# Altium project DAL_OBC_V10.PrjPcb (part 5 of 9)

## Sheet SAMA7G54_MPU.SchDoc
size 420 x 297 mm; SheetNumber: 10; SheetTotal: 34
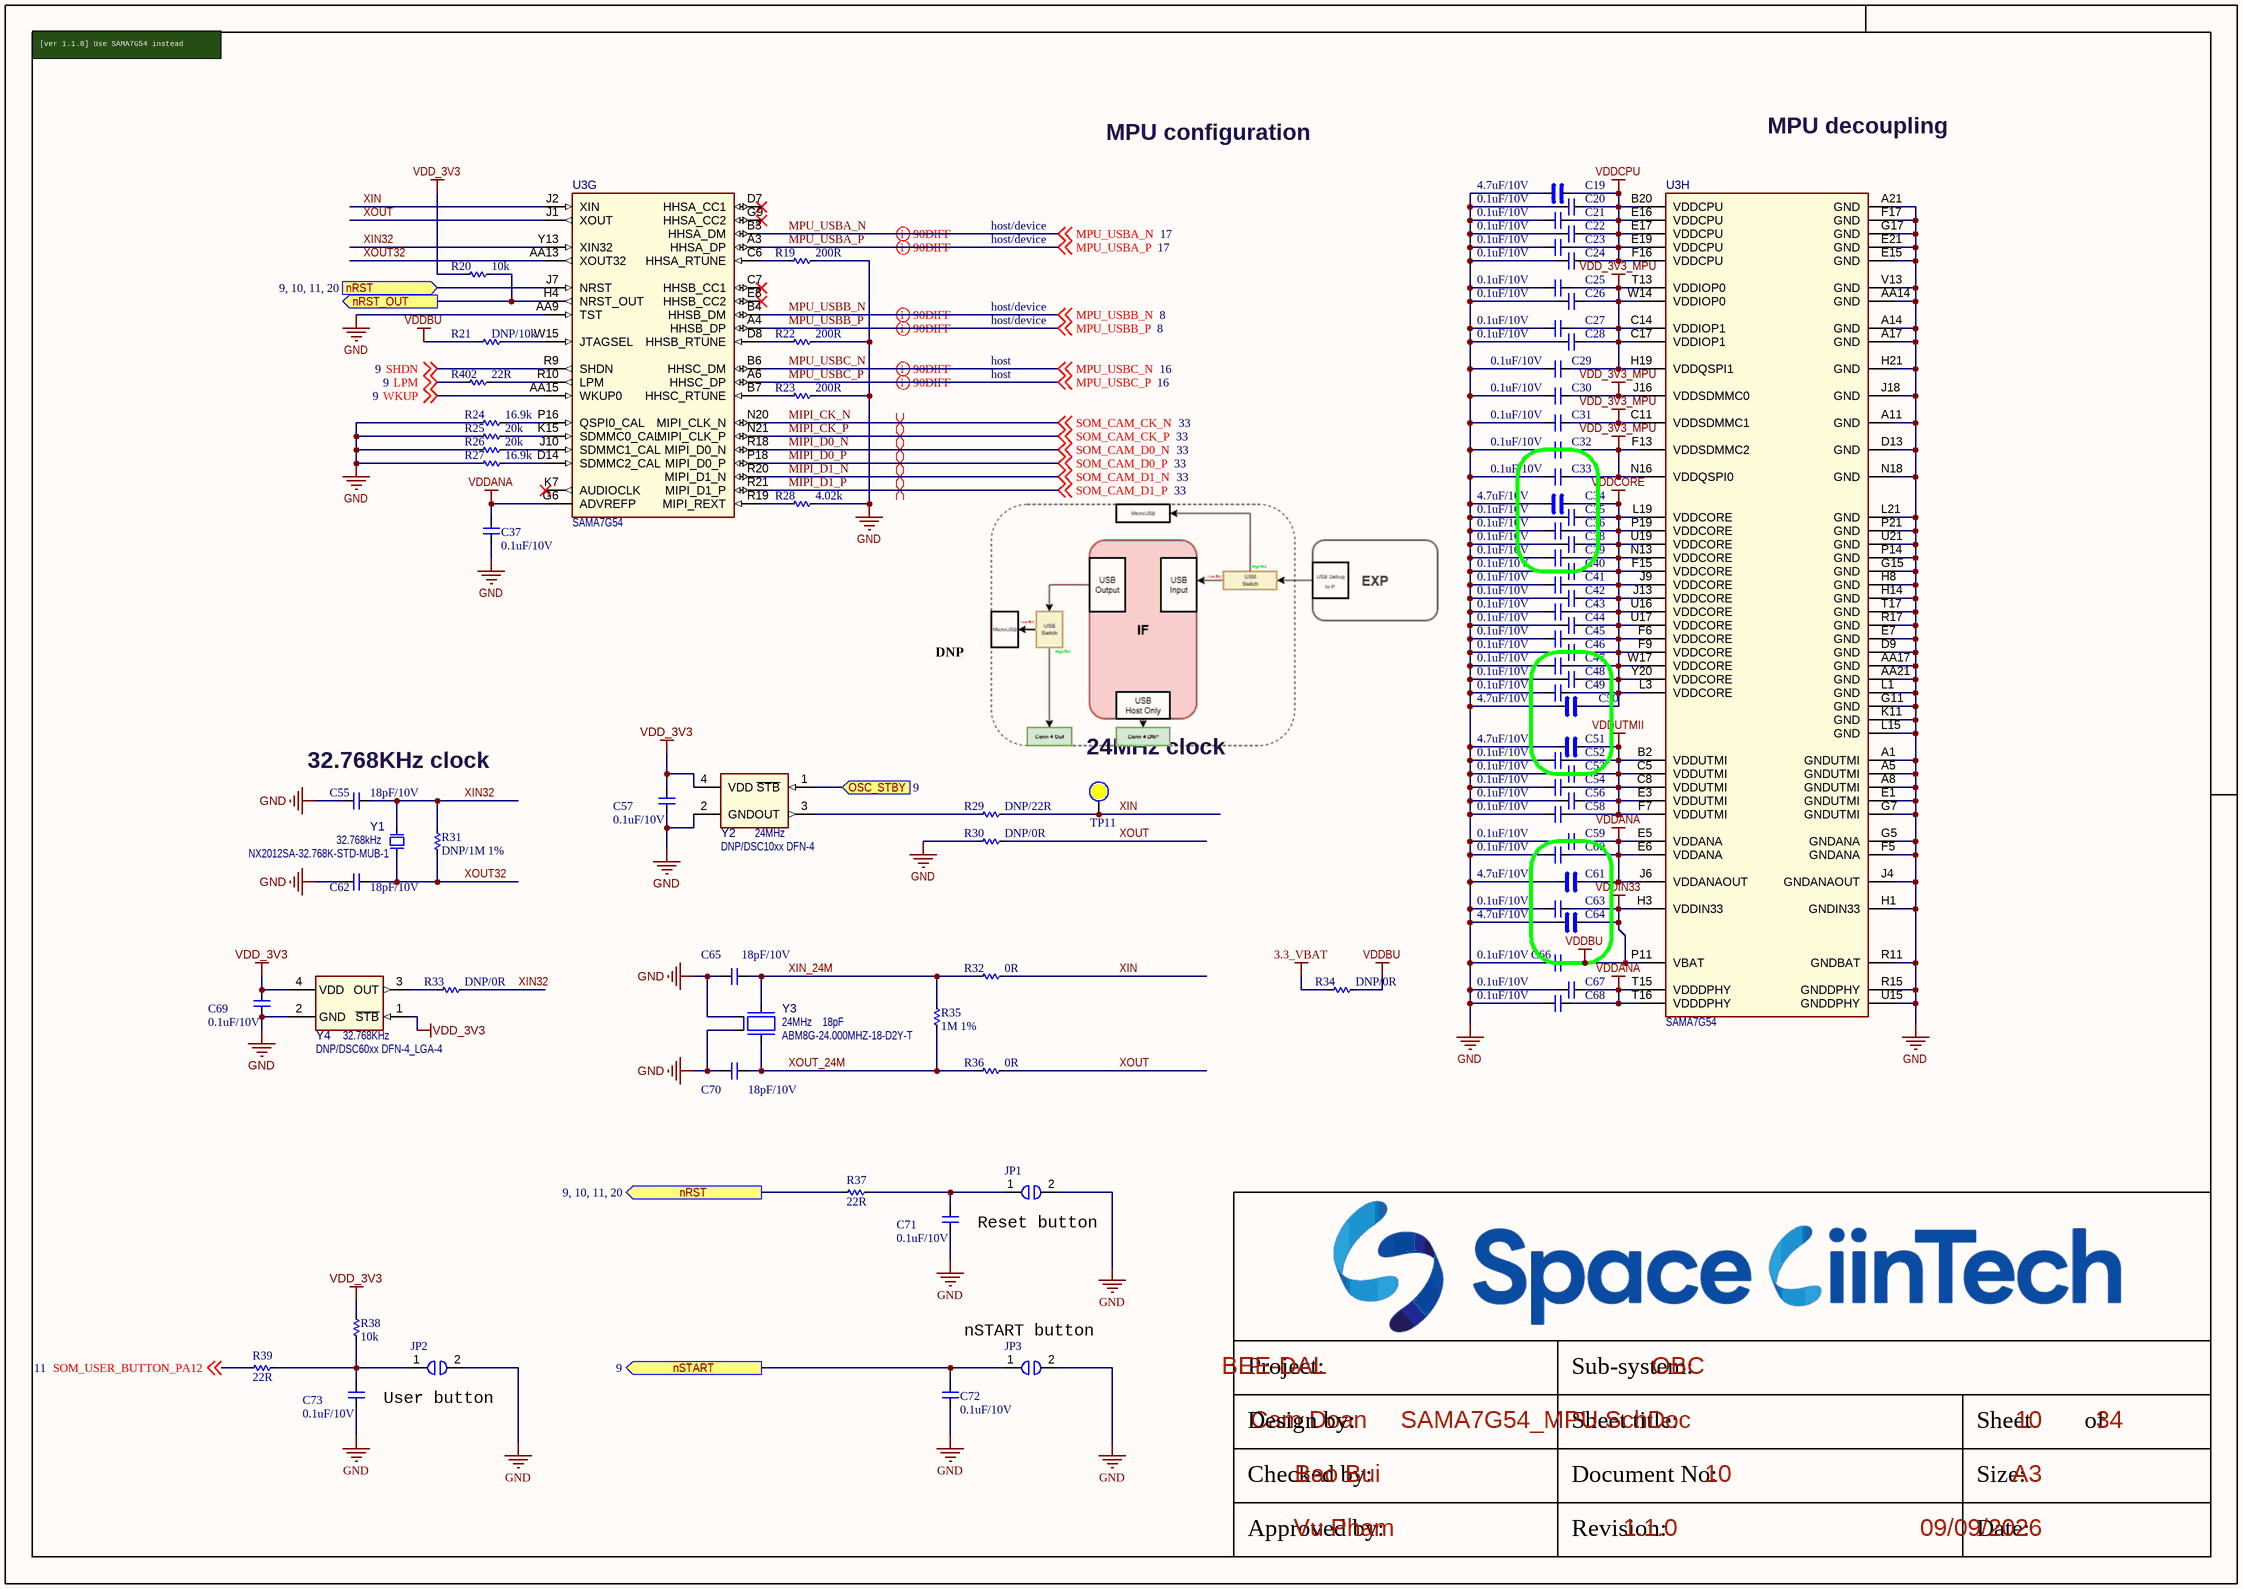
[diagram p9: SAMA7G54_MPU.SchDoc]

### Parts
C19  4.7uF/10V  [CAP_C_1005X50_L]
C20  0.1uF/10V  [CAP_C_0603x30]
C21  0.1uF/10V  [CAP_C_0603x30]
C22  0.1uF/10V  [CAP_C_0603x30]
C23  0.1uF/10V  [CAP_C_0603x30]
C24  0.1uF/10V  [CAP_C_0603x30]
C25  0.1uF/10V  [CAP_C_0603x30]
C26  0.1uF/10V  [CAP_C_0603x30]
C27  0.1uF/10V  [CAP_C_0603x30]
C28  0.1uF/10V  [CAP_C_0603x30]
C29  0.1uF/10V  [CAP_C_0603x30]
C30  0.1uF/10V  [CAP_C_0603x30]
C31  0.1uF/10V  [CAP_C_0603x30]
C32  0.1uF/10V  [CAP_C_0603x30]
C33  0.1uF/10V  [CAP_C_0603x30]
C34  4.7uF/10V  [CAP_C_1005X50_L]
C35  0.1uF/10V  [CAP_C_0603x30]
C36  0.1uF/10V  [CAP_C_0603x30]
C37  0.1uF/10V  [CAP_C_0603x30]
C38  0.1uF/10V  [CAP_C_0603x30]
C39  0.1uF/10V  [CAP_C_0603x30]
C40  0.1uF/10V  [CAP_C_0603x30]
C41  0.1uF/10V  [CAP_C_0603x30]
C42  0.1uF/10V  [CAP_C_0603x30]
C43  0.1uF/10V  [CAP_C_0603x30]
C44  0.1uF/10V  [CAP_C_0603x30]
C45  0.1uF/10V  [CAP_C_0603x30]
C46  0.1uF/10V  [CAP_C_0603x30]
C47  0.1uF/10V  [CAP_C_0603x30]
C48  0.1uF/10V  [CAP_C_0603x30]
C49  0.1uF/10V  [CAP_C_0603x30]
C50  4.7uF/10V  [CAP_C_1005X50_L]
C51  4.7uF/10V  [CAP_C_1005X50_L]
C52  0.1uF/10V  [CAP_C_0603x30]
C53  0.1uF/10V  [CAP_C_0603x30]
C54  0.1uF/10V  [CAP_C_0603x30]
C55  18pF/10V  [CAP_C_1005X50_L]
C56  0.1uF/10V  [CAP_C_0603x30]
C57  0.1uF/10V  [CAP_C_1005X50_L]
C58  0.1uF/10V  [CAP_C_0603x30]
C59  0.1uF/10V  [CAP_C_0603x30]
C60  0.1uF/10V  [CAP_C_0603x30]
C61  4.7uF/10V  [CAP_C_1005X50_L]
C62  18pF/10V  [CAP_C_1005X50_L]
C63  0.1uF/10V  [CAP_C_0603x30]
C64  4.7uF/10V  [CAP_C_1005X50_L]
C65  18pF/10V  [CAP_C_1005X50_L]
C66  0.1uF/10V  [CAP_C_0603x30]
C67  0.1uF/10V  [CAP_C_0603x30]
C68  0.1uF/10V  [CAP_C_0603x30]
C69  0.1uF/10V  [CAP_C_1005X50_L]
C70  18pF/10V  [CAP_C_1005X50_L]
C71  0.1uF/10V  [CAP_C_1005X50_L]
C72  0.1uF/10V  [CAP_C_1005X50_L]
C73  0.1uF/10V  [CAP_C_1005X50_L]
JP1  (no value)  [JUMPER_1608]
JP2  (no value)  [JUMPER_1608]
JP3  (no value)  [JUMPER_1608]
R19  200R  [RES_C_0603X30]
R20  10k  [RES_C_1005x30_L]
R21  DNP/10k  [RES_C_1005x30_L]
R22  200R  [RES_C_0603X30]
R23  200R  [RES_C_0603X30]
R24  16.9k  [RES_C_0603X30]
R25  20k  [RES_C_1005x30_L]
R26  20k  [RES_C_1005x30_L]
R27  16.9k  [RES_C_0603X30]
R28  4.02k  [RES_C_1005x30_L]
R29  DNP/22R  [RES_C_1005x30_L]
R30  DNP/0R  [RES_C_1005x30_L]
R31  DNP/1M 1%  [RES_C_1005x30_L]
R32  0R  [RES_C_1005x30_L]
R33  DNP/0R  [RES_C_1005x30_L]
R34  DNP/0R  [RES_C_1005x30_L]
R35  1M 1%  [RES_C_1005x30_L]
R36  0R  [RES_C_1005x30_L]
R37  22R  [RES_C_1005x30_L]
R38  10k  [RES_C_1005x30_L]
R39  22R  [RES_C_1005x30_L]
R402  22R  [RES_C_1005x30_L]
TP11  (no value)  [Testpoint_80_pin0]  (no BOM)
U3  SAMA7G54  [TFBGA-343_14x14 - 2.5mm]  (parts G,H of 8)
Y1  value 32.768kHz  Manufacturer Part Number 1: NX2012SA-32.768K-STD-MUB-1  [CRYSTAL_NX2012SA]  (hidden comment: Crystal 2 Pins)
Y2  DNP/DSC10xx DFN-4  value 24MHz  [DFN-4_2.5x2]
Y3  value 24MHz  Load Capacitance: 18pF  Manufacturer Part Number 1: ABM8G-24.000MHZ-18-D2Y-T  [CRYSTAL_ABM8G]  (hidden comment: Crystal 4 Pins)
Y4  DNP/DSC60xx DFN-4_LGA-4  value 32.768KHz  [DFN-4_2x1.6]

### Ports
nRST (in, see 9, 10, 11, 20), nRST (out, see 9, 10, 11, 20), nRST_OUT (out), nSTART (out, see 9), OSC_STBY (in, see 9)

### Nets
3.3_VBAT: R34.1
GND: C19.2 C20.2 C21.2 C22.2 C23.2 C24.2 C25.2 C26.2 C27.2 C28.2 C29.2 C30.2 C31.2 C32.2 C33.2 C34.2 C35.2 C36.2 C37.1 C38.2 C39.2 C40.2 C41.2 C42.2 C43.2 C44.2 C45.2 C46.2 C47.2 C48.2 C49.2 C50.2 C51.2 C52.2 C53.2 C54.2 C55.2 C56.2 C57.1 C58.2 C59.2 C60.2 C61.2 C62.2 C63.2 C64.2 C65.2 C66.2 C67.2 C68.2 C69.1 C70.2 C71.1 C72.2 C73.1 JP1.2 JP2.2 JP3.2 R19.1 R22.1 R23.1 R24.2 R25.2 R26.2 R27.2 R28.1 R30.1 U3.A1(GNDUTMI) U3.A5(GNDUTMI) U3.A8(GNDUTMI) U3.A11(GND) U3.A14(GND) U3.A17(GND) U3.A21(GND) U3.AA9(TST) U3.AA14(GND) U3.AA17(GND) U3.AA21(GND) U3.D9(GND) U3.D13(GND) U3.E1(GNDUTMI) U3.E7(GND) U3.E15(GND) U3.E21(GND) U3.F5(GNDANA) U3.F17(GND) U3.G5(GNDANA) U3.G7(GNDUTMI) U3.G11(GND) U3.G15(GND) U3.G17(GND) U3.H1(GNDIN33) U3.H8(GND) U3.H14(GND) U3.H21(GND) U3.J4(GNDANAOUT) U3.J18(GND) U3.K11(GND) U3.L1(GND) U3.L15(GND) U3.L21(GND) U3.N18(GND) U3.P14(GND) U3.P21(GND) U3.R11(GNDBAT) U3.R15(GNDDPHY) U3.R17(GND) U3.T17(GND) U3.U15(GNDDPHY) U3.U21(GND) U3.V13(GND) Y2.2(GND) Y3.2(GND) Y3.4(GND) Y4.2(GND)  [project net AGND]
VDD_3V3: C57.2 C69.2 R20.2 R38.2 Y2.4(VDD) Y4.1(~{STB}) Y4.4(VDD)
VDD_3V3_MPU: C25.1 C26.1 C27.1 C28.1 C29.1 C30.1 C31.1 C32.1 C33.1 C51.1 C52.1 C53.1 C54.1 C56.1 C58.1 C63.1 C64.1 C66.1 R21.2 R34.2 U3.B2(VDDUTMI) U3.C5(VDDUTMI) U3.C8(VDDUTMI) U3.C11(VDDSDMMC1) U3.C14(VDDIOP1) U3.C17(VDDIOP1) U3.E3(VDDUTMI) U3.F7(VDDUTMI) U3.F13(VDDSDMMC2) U3.H3(VDDIN33) U3.H19(VDDQSPI1) U3.J16(VDDSDMMC0) U3.N16(VDDQSPI0) U3.P11(VBAT) U3.T13(VDDIOP0) U3.W14(VDDIOP0)  [also labelled VDDBU, VDDIN33, VDDUTMII]
VDDANA: C37.2 C59.1 C60.1 C61.1 C67.1 C68.1 U3.E5(VDDANA) U3.E6(VDDANA) U3.G6(ADVREFP) U3.J6(VDDANAOUT) U3.T15(VDDDPHY) U3.T16(VDDDPHY)
VDDCORE: C34.1 C35.1 C36.1 C38.1 C39.1 C40.1 C41.1 C42.1 C43.1 C44.1 C45.1 C46.1 C47.1 C48.1 C49.1 C50.1 U3.F6(VDDCORE) U3.F9(VDDCORE) U3.F15(VDDCORE) U3.J9(VDDCORE) U3.J13(VDDCORE) U3.L3(VDDCORE) U3.L19(VDDCORE) U3.N13(VDDCORE) U3.P19(VDDCORE) U3.U16(VDDCORE) U3.U17(VDDCORE) U3.U19(VDDCORE) U3.W17(VDDCORE) U3.Y20(VDDCORE)
VDDCPU: C19.1 C20.1 C21.1 C22.1 C23.1 C24.1 U3.B20(VDDCPU) U3.E16(VDDCPU) U3.E17(VDDCPU) U3.E19(VDDCPU) U3.F16(VDDCPU)
LPM: R402.1 ; off-sheet LPM
MIPI_CK_N: U3.N20(MIPI_CLK_N) ; off-sheet SOM_CAM_CK_N  [also labelled SOM_CAM_CK_N]
MIPI_CK_P: U3.N21(MIPI_CLK_P) ; off-sheet SOM_CAM_CK_P  [also labelled SOM_CAM_CK_P]
MIPI_D0_N: U3.R18(MIPI_D0_N) ; off-sheet SOM_CAM_D0_N  [also labelled SOM_CAM_D0_N]
MIPI_D0_P: U3.P18(MIPI_D0_P) ; off-sheet SOM_CAM_D0_P  [also labelled SOM_CAM_D0_P]
MIPI_D1_N: U3.R20(MIPI_D1_N) ; off-sheet SOM_CAM_D1_N  [also labelled SOM_CAM_D1_N]
MIPI_D1_P: U3.R21(MIPI_D1_P) ; off-sheet SOM_CAM_D1_P  [also labelled SOM_CAM_D1_P]
MPU_USBA_N: U3.B3(HHSA_DM) ; off-sheet MPU_USBA_N
MPU_USBA_P: U3.A3(HHSA_DP) ; off-sheet MPU_USBA_P
MPU_USBB_N: U3.B4(HHSB_DM) ; off-sheet MPU_USBB_N
MPU_USBB_P: U3.A4(HHSB_DP) ; off-sheet MPU_USBB_P
MPU_USBC_N: U3.B6(HHSC_DM) ; off-sheet MPU_USBC_N
MPU_USBC_P: U3.A6(HHSC_DP) ; off-sheet MPU_USBC_P
SHDN: U3.R9(SHDN) ; off-sheet SHDN
SOM_USER_BUTTON_PA12: R39.1 ; off-sheet SOM_USER_BUTTON_PA12
WKUP: U3.AA15(WKUP0) ; off-sheet WKUP
XIN: R29.2 R32.2 TP11.0 U3.J2(XIN)
XIN32: C55.1 R31.1 R33.2 U3.Y13(XIN32) Y1.2(Osc2)
XIN_24M: C65.1 R32.1 R35.2 Y3.3(Osc2)
XOUT: R30.2 R36.2 U3.J1(XOUT)
XOUT32: C62.1 R31.2 U3.AA13(XOUT32) Y1.1(Osc1)
XOUT_24M: C70.1 R35.1 R36.1 Y3.1(Osc1)
NetC71_2: C71.2 JP1.1 R37.2
NetC72_1: C72.1 JP3.1 ; port nSTART
NetC73_2: C73.2 JP2.1 R38.1 R39.2
NetC75_2: R37.1 U3.J7(NRST) ; port nRST
NetQ1_3: Y2.1(~{STB}) ; port OSC_STBY
NetR19_2: R19.2 U3.C6(HHSA_RTUNE)
NetR20_1: R20.1 U3.H4(NRST_OUT) ; port nRST_OUT
NetR21_1: R21.1 U3.W15(JTAGSEL)
NetR22_2: R22.2 U3.D8(HHSB_RTUNE)
NetR23_2: R23.2 U3.B7(HHSC_RTUNE)
NetR24_1: R24.1 U3.P16(QSPI0_CAL)
NetR25_1: R25.1 U3.K15(SDMMC0_CAL)
NetR26_1: R26.1 U3.J10(SDMMC1_CAL)
NetR27_1: R27.1 U3.D14(SDMMC2_CAL)
NetR28_2: R28.2 U3.R19(MIPI_REXT)
NetR29_1: R29.1 Y2.3(OUT)
NetR33_1: R33.1 Y4.3(OUT)
NetR402_2: R402.2 U3.R10(LPM)

Not connected (* = marked no-connect by the designer): U3 C7(HHSB_CC1)* D7(HHSA_CC1)* E8(HHSB_CC2)* G9(HHSA_CC2)* K7(AUDIOCLK)*

### Layout directives
differential pair; differential pair class DIFF90; net class DIFF90: MPU_USBA_N, MPU_USBA_P, MPU_USBB_N, MPU_USBB_P, MPU_USBC_N, MPU_USBC_P
differential pair; net class DIFF100; differential pair class DIFF100: MIPI_CK_N, MIPI_CK_P, MIPI_D0_N, MIPI_D0_P, MIPI_D1_N, MIPI_D1_P

### Notes on the sheet
- [ver 1.1.0] Use SAMA7G54 instead
- MPU configuration
- MPU decoupling
- host/device
- host
- DNP
- (near C55) 32.768KHz clock
- (near TP11) 24MHz clock
- Reset button
- (near JP3) nSTART button
- User button
- Project:
- Sub-system:
- Design by:
- Sheet title:
- Sheet
- of
- Checked by:
- Approved by:
- Revision:
- Document No:
- Size:
- Date:
- A3

### Library data of the parts
C19 C34 C50 C51 C61 C64 = _CAP_C_High_2: CAP
C20-C33 C35-C49 C52-C60 C62 C63 C65-C71 C73 = _CAP_C_2: CAP
C72 = _CAP_C_2: CAP CHIP
JP1-JP3 = JUMPER_1_1
R19-R39 R402 = _RES_B_2: RES
TP11 = Test Point: Solder: NF
U3 = SAMA7G54: SAMA7G54 MPU 1000MHz Cortex-A7 TFBGA-343; Manufacturer Part Number 1: SAMA7G54-V/4HB; Manufacturer 1: Microchip; Description_: MCHP MPU 32-BIT Cortex-A7 1000MHz 128kB SAMA7G54-V/4HB TFBGA-343; Populated: YES; MCHP-ID: MIC8923; Symbol: SAMA7G54 TFBGA-343; Dev Tools Status: Design; Owner: Ciprian Abramov; Package: TFBGA-343; Value: SAMA7G54; Type: 32-Bit MPU; Status: MCL Design; Revision: 1; Category: MCHP-Microcontroller; ComponentLink1Description: SVN Datasheet; ComponentLink2Description: Local Datasheet; ComponentLink3URL: C:\ALTIUM_WORK\00001_MCHP-CDB\Library\LibraryRefs\SAMA7G54 TFBGA-343.SchLib; ComponentLink3Description: Open Symbol; ComponentLink4URL: C:\ALTIUM_WORK\00001_MCHP-CDB\Library\Footprints\TFBGA-343_14x14.PcbLib; ComponentLink4Description: Open Footprint; ComponentLink5Description: Open Footprint 2; ComponentLink6Description: Open Footprint 3; ComponentLink7Description: Open Footprint 4; Supplier 1: Microchip; Supplier Part Number 1: SAMA7G54-V/4HB; Quantity Override: 1
Y1 = OSC_32.768kHz: Crystal; Manufacturer 1: NDK; MCHP-ID: OSC1092; Description_: CRYSTAL 32.768kHz 12.5pF SMD NX2012SA; Dev Tools Status: Production; Owner: Jamus Griego; Tolerance: ±20ppm; Load Capacitance: 12.5pF; Populated: YES; Revision: 1; Symbol: Crystal 2 Pins; Status: MCL Design; ComponentLink1URL: https://chn-vm-apps.microchip.com/mchprepo/parts/Datasheets/c_NX2012SA-STD-MUB-1_e.pdf; ComponentLink1Description: SVN Datasheet; ComponentLink2URL: C:\ALTIUM_WORK\00001_MCHP-CDB\Datasheets\c_NX2012SA-STD-MUB-1_e.pdf; ComponentLink2Description: Local Datasheet; ComponentLink3URL: C:\ALTIUM_WORK\00001_MCHP-CDB\Library\LibraryRefs\Crystal 2 Pins.SchLib; ComponentLink3Description: Open Symbol; ComponentLink4URL: C:\ALTIUM_WORK\00001_MCHP-CDB\Library\Footprints\CRYSTAL_NX2012SA.PcbLib; ComponentLink4Description: Open Footprint; ComponentLink5Description: Open Footprint 2; ComponentLink6Description: Open Footprint 3; ComponentLink7Description: Open Footprint 4; Type: Crystal; Category: Crystal/Oscillator; Supplier 1: Digi-Key; Supplier Part Number 1: 644-1219-1-ND; Quantity Override: 1
Y2 = MIC6659: Manufacturer 1: Microchip Technology; Manufacturer Part Number 1: DSC1001DI5-024.0000T; Description_: MCHP CLOCK OSCILLATOR SINGLE 24MHz DSC1001DI5-024.0000 SMD-2520; Dev Tools Status: Design; Owner: Maurizio Gavardoni; Populated: YES; MCHP-ID: MIC6659; Revision: A; Symbol: DSC10xx DFN-4; Status: MCL Design; ComponentLink1Description: SVN Datasheet; ComponentLink2Description: Local Datasheet; ComponentLink3URL: C:\ALTIUM_WORK\00001_MCHP-CDB\Library\LibraryRefs\DSC10xx DFN-4.SchLib; ComponentLink3Description: Open Symbol; ComponentLink4URL: C:\ALTIUM_WORK\00001_MCHP-CDB\Library\Footprints\DFN-4_2.5x2.PcbLib; ComponentLink4Description: Open Footprint; ComponentLink5Description: Open Footprint 2; ComponentLink6Description: Open Footprint 3; ComponentLink7Description: Open Footprint 4; Category: MCHP-Clock/Timing; Type: Oscillator; Supplier 1: Digi-Key; Supplier Part Number 1: DSC1001DI5-024.0000T-ND; Quantity Override: 1
Y3 = OSC_24MHz: Crystal; Manufacturer 1: Abracon Corporation; MCHP-ID: OSC1047; Description_: CRYSTAL 24MHz 18pF SMD ABM8G; Dev Tools Status: Production; Owner: Mark Loper; Populated: DNP; Revision: 1; Symbol: Crystal 4 Pins; Status: MCL Design; ComponentLink1URL: https://chn-vm-apps.microchip.com/mchprepo/parts/Datasheets/ABM8G.pdf; ComponentLink1Description: SVN Datasheet; ComponentLink2URL: C:\ALTIUM_WORK\00001_MCHP-CDB\Datasheets\ABM8G.pdf; ComponentLink2Description: Local Datasheet; ComponentLink3URL: C:\ALTIUM_WORK\00001_MCHP-CDB\Library\LibraryRefs\Crystal 4 Pins.SchLib; ComponentLink3Description: Open Symbol; ComponentLink4URL: C:\ALTIUM_WORK\00001_MCHP-CDB\Library\Footprints\CRYSTAL_ABM8G.PcbLib; ComponentLink4Description: Open Footprint; ComponentLink5Description: Open Footprint 2; ComponentLink6Description: Open Footprint 3; ComponentLink7Description: Open Footprint 4; Package: ABM8G; Type: Crystal; Category: Crystal/Oscillator; Supplier 1: Digi-Key; Supplier Part Number 1: 535-10273-1-ND; Quantity Override: 1
Y4 = MIC8888: Manufacturer 1: Microchip Technology; Manufacturer Part Number 1: DSC6003MA3B-032K768; Description_: MCHP CLOCK OSCILLATOR SINGLE 32.768KHz DSC6003MA3B-032K768 SMD DFN-4; Dev Tools Status: Design; Owner: Ciprian Abramov; Populated: DNP; MCHP-ID: MIC8888; Revision: 1; Symbol: DSC60xx DFN-4_LGA-4; Status: MCL Design; ComponentLink1Description: SVN Datasheet; ComponentLink2Description: Local Datasheet; ComponentLink3URL: C:\ALTIUM_WORK\00001_MCHP-CDB\Library\LibraryRefs\DSC60xx DFN-4_LGA-4.SchLib; ComponentLink3Description: Open Symbol; ComponentLink4URL: C:\ALTIUM_WORK\00001_MCHP-CDB\Library\Footprints\DFN-4_2x1.6.PcbLib; ComponentLink4Description: Open Footprint; ComponentLink5Description: Open Footprint 2; ComponentLink6Description: Open Footprint 3; ComponentLink7Description: Open Footprint 4; Category: MCHP-Clock/Timing; Type: Oscillator; Supplier 1: Digi-Key; Supplier Part Number 1: DSC6003MA3B-032K768-ND; Quantity Override: 1; Supplier 2: Mouser; Supplier Part Number 2: 579-6003MA3B032K768

## Sheet SAMA7G54_PIO.SchDoc
size 420 x 297 mm; SheetNumber: 11; SheetTotal: 34
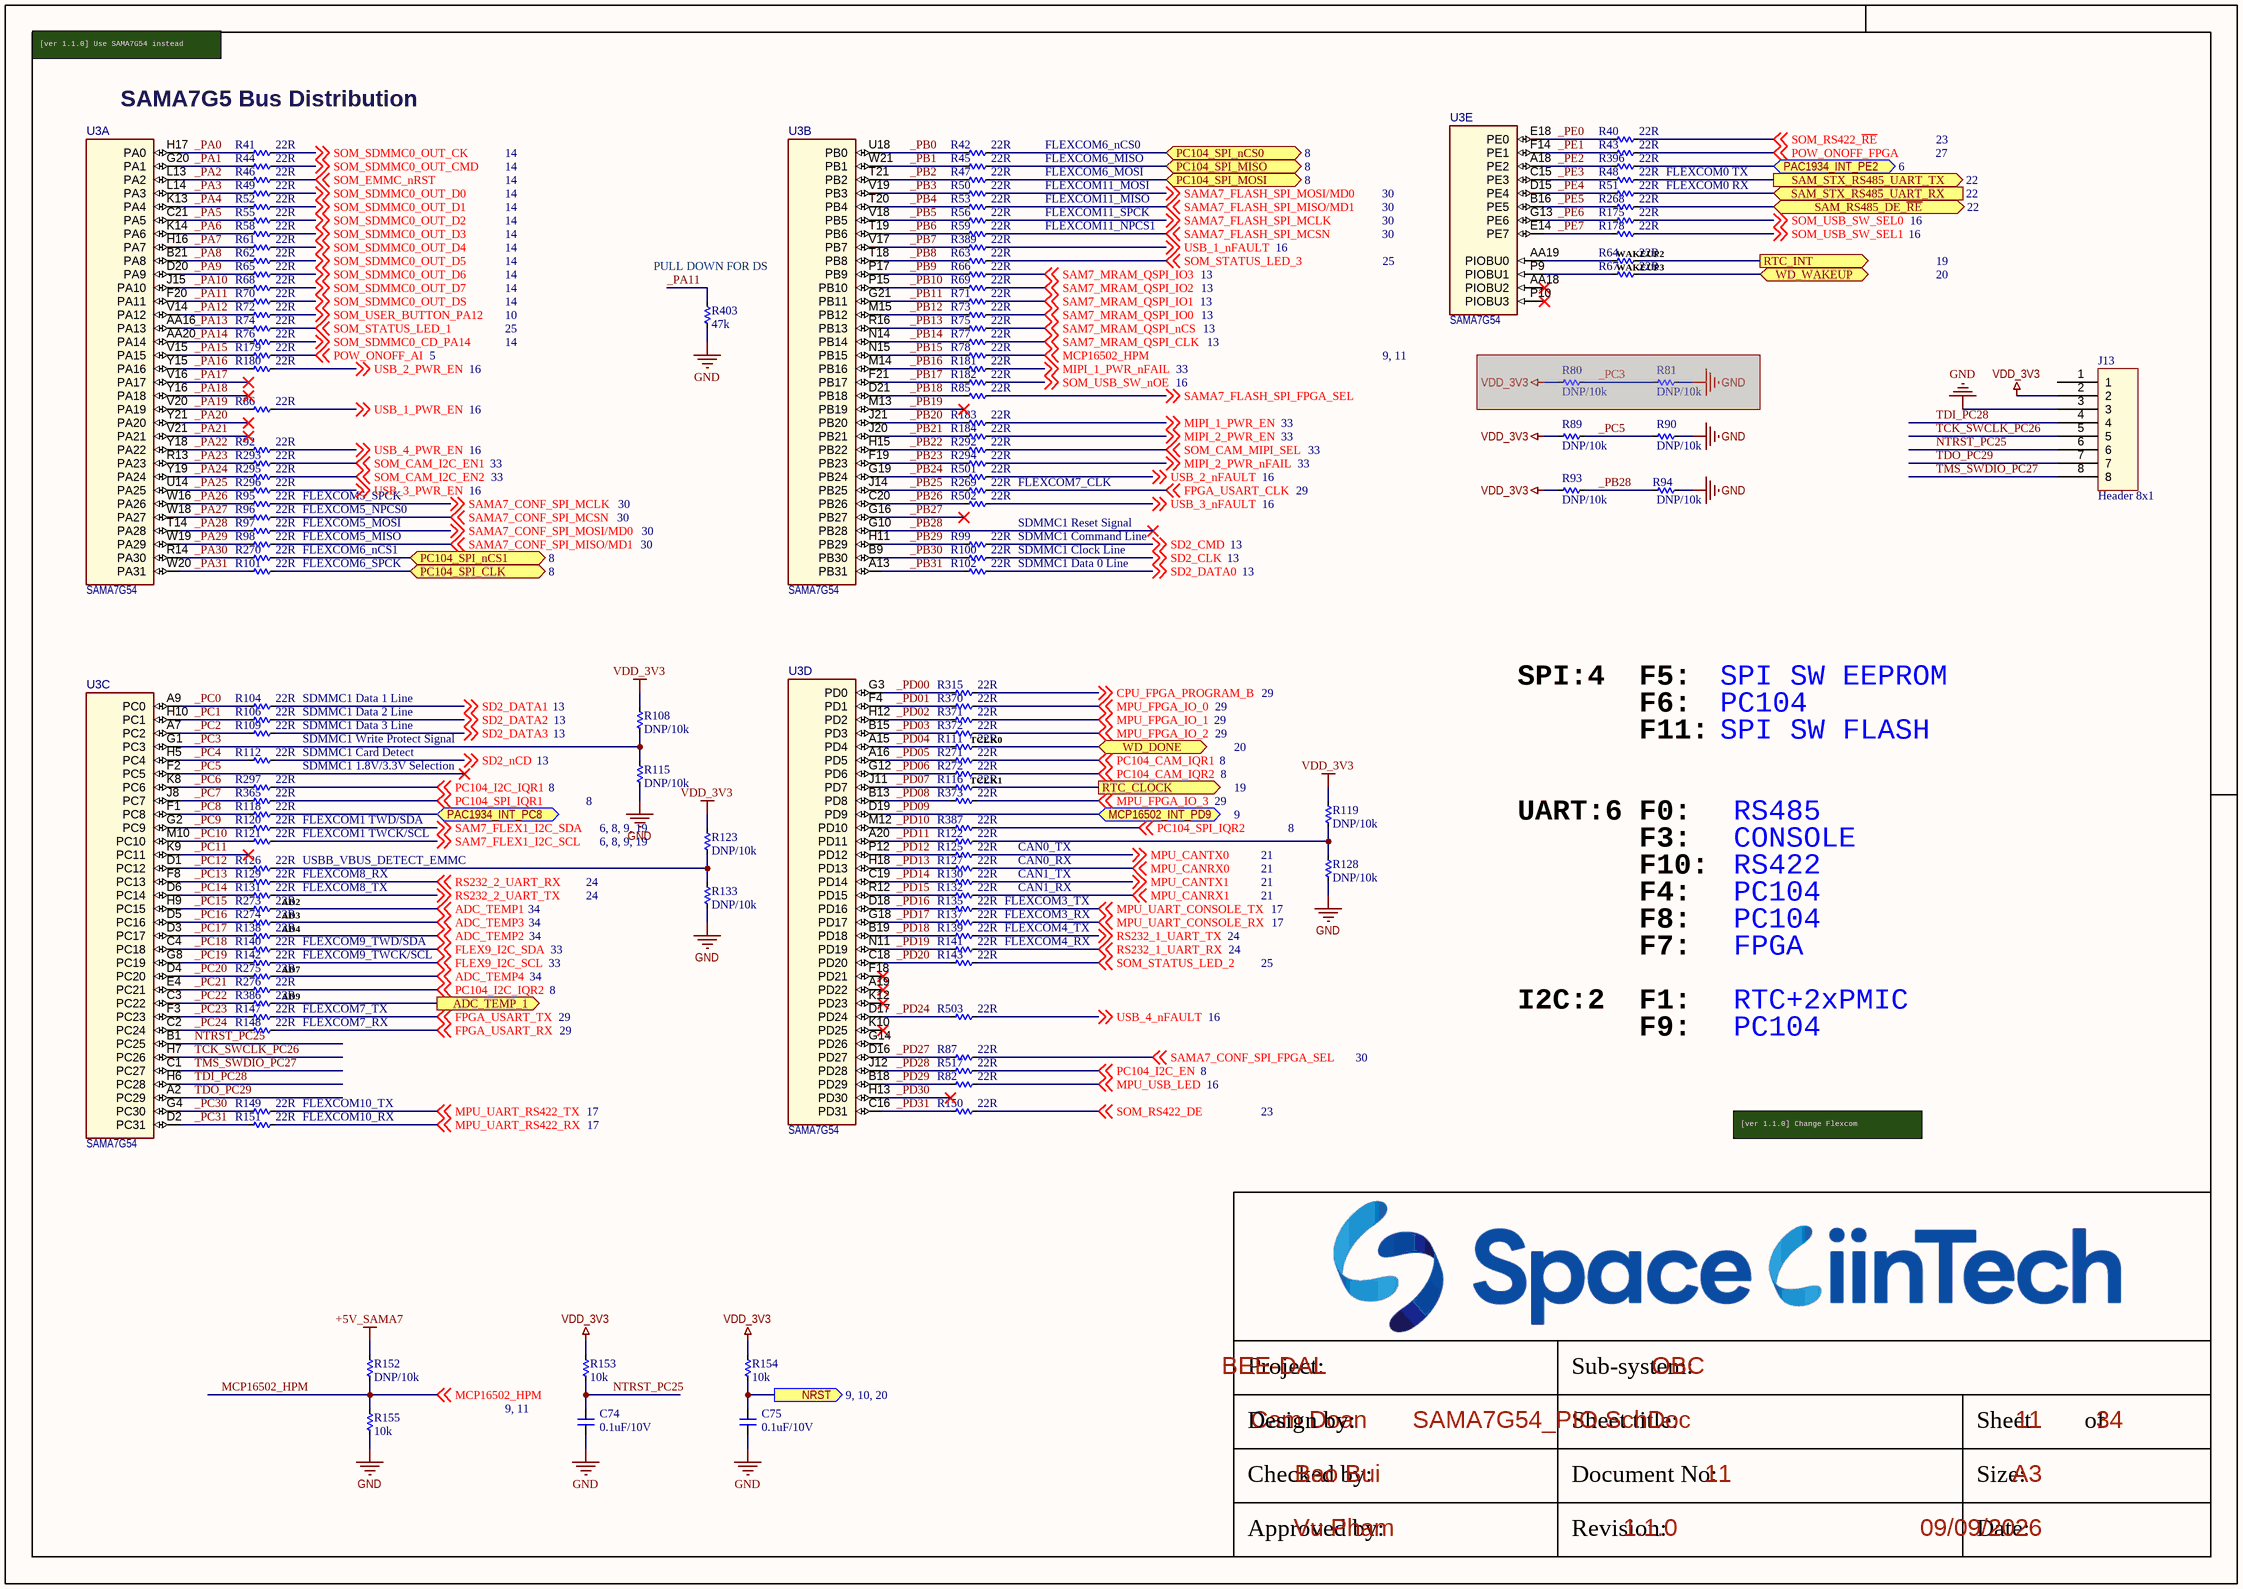
[diagram p10: SAMA7G54_PIO.SchDoc]

### Parts
(Parts that share a designator on the sheet are numbered #1, #2 ... from top to bottom, then left to right.)
C74  0.1uF/10V  [CAP_C_1005X50_L]
C75  0.1uF/10V  [CAP_C_1005X50_L]
J13  Header 8x1  [PAD JTAG 1.27]
R40  22R  [RES_C_1005x30_L]
R41  22R  [RES_C_1005x30_L]
R42  22R  [RES_C_1005x30_L]
R43  22R  [RES_C_1005x30_L]
R44  22R  [RES_C_1005x30_L]
R45  22R  [RES_C_1005x30_L]
R46  22R  [RES_C_1005x30_L]
R47  22R  [RES_C_1005x30_L]
R48  22R  [RES_C_1005x30_L]
R49  22R  [RES_C_1005x30_L]
R50  22R  [RES_C_1005x30_L]
R51  22R  [RES_C_1005x30_L]
R52  22R  [RES_C_1005x30_L]
R53  22R  [RES_C_1005x30_L]
R55  22R  [RES_C_1005x30_L]
R56  22R  [RES_C_1005x30_L]
R58  22R  [RES_C_1005x30_L]
R59  22R  [RES_C_1005x30_L]
R61  22R  [RES_C_1005x30_L]
R62  22R  [RES_C_1005x30_L]
R63  22R  [RES_C_1005x30_L]
R64  22R  [RES_C_1005x30_L]
R65  22R  [RES_C_1005x30_L]
R66  22R  [RES_C_1005x30_L]
R67  22R  [RES_C_1005x30_L]
R68  22R  [RES_C_1005x30_L]
R69  22R  [RES_C_1005x30_L]
R70  22R  [RES_C_1005x30_L]
R71  22R  [RES_C_1005x30_L]
R72  22R  [RES_C_1005x30_L]
R73  22R  [RES_C_1005x30_L]
R74  22R  [RES_C_1005x30_L]
R75  22R  [RES_C_1005x30_L]
R76  22R  [RES_C_1005x30_L]
R77  22R  [RES_C_1005x30_L]
R78  22R  [RES_C_1005x30_L]
R80#2  DNP/10k  [RES_C_1005x30_L]  (masked out: inside a compile mask, not in the netlist)
R81#2  DNP/10k  [RES_C_1005x30_L]  (masked out: inside a compile mask, not in the netlist)
R82  22R  [RES_C_1005x30_L]
R85  22R  [RES_C_1005x30_L]
R86  22R  [RES_C_1005x30_L]
R87  22R  [RES_C_1005x30_L]
R89  DNP/10k  [RES_C_1005x30_L]
R90  DNP/10k  [RES_C_1005x30_L]
R92  22R  [RES_C_1005x30_L]
R93  DNP/10k  [RES_C_1005x30_L]
R94  DNP/10k  [RES_C_1005x30_L]
R95  22R  [RES_C_1005x30_L]
R96  22R  [RES_C_1005x30_L]
R97  22R  [RES_C_1005x30_L]
R98  22R  [RES_C_1005x30_L]
R99  22R  [RES_C_1005x30_L]
R100  22R  [RES_C_1005x30_L]
R101  22R  [RES_C_1005x30_L]
R102  22R  [RES_C_1005x30_L]
R104  22R  [RES_C_1005x30_L]
R106  22R  [RES_C_1005x30_L]
R108  DNP/10k  [RES_C_1005x30_L]
R109  22R  [RES_C_1005x30_L]
R111  22R  [RES_C_1005x30_L]
R112  22R  [RES_C_1005x30_L]
R115  DNP/10k  [RES_C_1005x30_L]
R116  22R  [RES_C_1005x30_L]
R118  22R  [RES_C_1005x30_L]
R119  DNP/10k  [RES_C_1005x30_L]
R120  22R  [RES_C_1005x30_L]
R121  22R  [RES_C_1005x30_L]
R122  22R  [RES_C_1005x30_L]
R123  DNP/10k  [RES_C_1005x30_L]
R125  22R  [RES_C_1005x30_L]
R126  22R  [RES_C_1005x30_L]
R127  22R  [RES_C_1005x30_L]
R128  DNP/10k  [RES_C_1005x30_L]
R129  22R  [RES_C_1005x30_L]
R130  22R  [RES_C_1005x30_L]
R131  22R  [RES_C_1005x30_L]
R132  22R  [RES_C_1005x30_L]
R133  DNP/10k  [RES_C_1005x30_L]
R135  22R  [RES_C_1005x30_L]
R137  22R  [RES_C_1005x30_L]
R138  22R  [RES_C_1005x30_L]
R139  22R  [RES_C_1005x30_L]
R140  22R  [RES_C_1005x30_L]
R141  22R  [RES_C_1005x30_L]
R142  22R  [RES_C_1005x30_L]
R143  22R  [RES_C_1005x30_L]
R147  22R  [RES_C_1005x30_L]
R148  22R  [RES_C_1005x30_L]
R149  22R  [RES_C_1005x30_L]
R150  22R  [RES_C_1005x30_L]
R151  22R  [RES_C_1005x30_L]
R152  DNP/10k  [RES_C_1005x30_L]
R153  10k  [RES_C_1005x30_L]
R154  10k  [RES_C_1005x30_L]
R155  10k  [RES_C_1005x30_L]
R175  22R  [RES_C_1005x30_L]
R178  22R  [RES_C_1005x30_L]
R179  22R  [RES_C_1005x30_L]
R180  22R  [RES_C_1005x30_L]
R181  22R  [RES_C_1005x30_L]
R182  22R  [RES_C_1005x30_L]
R183  22R  [RES_C_1005x30_L]
R184  22R  [RES_C_1005x30_L]
R268  22R  [RES_C_1005x30_L]
R269  22R  [RES_C_1005x30_L]
R270  22R  [RES_C_1005x30_L]
R271  22R  [RES_C_1005x30_L]
R272  22R  [RES_C_1005x30_L]
R273  22R  [RES_C_1005x30_L]
R274  22R  [RES_C_1005x30_L]
R275  22R  [RES_C_1005x30_L]
R276  22R  [RES_C_1005x30_L]
R292  22R  [RES_C_1005x30_L]
R293  22R  [RES_C_1005x30_L]
R294  22R  [RES_C_1005x30_L]
R295  22R  [RES_C_1005x30_L]
R296  22R  [RES_C_1005x30_L]
R297  22R  [RES_C_1005x30_L]
R315  22R  [RES_C_1005x30_L]
R365  22R  [RES_C_1005x30_L]
R370  22R  [RES_C_1005x30_L]
R371  22R  [RES_C_1005x30_L]
R372  22R  [RES_C_1005x30_L]
R373  22R  [RES_C_1005x30_L]
R386  22R  [RES_C_1005x30_L]
R387  22R  [RES_C_1005x30_L]
R389  22R  [RES_C_1005x30_L]
R396  22R  [RES_C_1005x30_L]
R403  47k  [RES_C_1005x30_L]
R501  22R  [RES_C_1005x30_L]
R502  22R  [RES_C_1005x30_L]
R503  22R  [RES_C_1005x30_L]
R517  22R  [RES_C_1005x30_L]
U3  SAMA7G54  [TFBGA-343_14x14 - 2.5mm]  (parts A,B,C,D,E of 8)

### Ports
ADC_TEMP_1 (out, see 18), MCP16502_INT_PD9 (bidir, see 9), NRST (out, see 9, 10, 20), PAC1934_INT_PC8 (bidir, see 9), PAC1934_INT_PE2 (bidir, see 6), PC104_SPI_CLK (bidir, see 8), PC104_SPI_MISO (bidir, see 8), PC104_SPI_MOSI (bidir, see 8), PC104_SPI_nCS0 (bidir, see 8), PC104_SPI_nCS1 (bidir, see 8), RTC_CLOCK (out, see 19), RTC_INT (out, see 19), SAM_RS485_DE_~{RE} (bidir, see 22), SAM_STX_RS485_UART_RX (in, see 22), SAM_STX_RS485_UART_TX (out, see 22), WD_DONE (bidir, see 20), WD_WAKEUP (bidir, see 20)

### Nets
+5V_SAMA7: R152.1
GND: C74.1 C75.1 J13.3 R90.1 R94.1 R115.2 R128.2 R133.2 R155.2 R403.2  [project net AGND]
VDD_3V3: J13.2 R89.2 R93.2 R108.1 R119.1 R123.1 R153.2 R154.2
_PA0: R41.2 U3.H17(PA0)
_PA1: R44.2 U3.G20(PA1)
_PA2: R46.2 U3.L13(PA2)
_PA3: R49.2 U3.L14(PA3)
_PA4: R52.2 U3.K13(PA4)
_PA5: R55.2 U3.C21(PA5)
_PA6: R58.2 U3.K14(PA6)
_PA7: R61.2 U3.H16(PA7)
_PA8: R62.2 U3.B21(PA8)
_PA9: R65.2 U3.D20(PA9)
_PA10: R68.2 U3.J15(PA10)
_PA11: R70.2 R403.1 U3.F20(PA11)
_PA12: R72.2 U3.V14(PA12)
_PA13: R74.2 U3.AA16(PA13)
_PA14: R76.2 U3.AA20(PA14)
_PA15: R179.2 U3.V15(PA15)
_PA16: R180.2 U3.Y15(PA16)
_PA17: U3.V16(PA17)
_PA18: U3.Y16(PA18)
_PA19: R86.2 U3.V20(PA19)
_PA20: U3.Y21(PA20)
_PA21: U3.V21(PA21)
_PA22: R92.2 U3.Y18(PA22)
_PA23: R293.2 U3.R13(PA23)
_PA24: R295.2 U3.Y19(PA24)
_PA25: R296.2 U3.U14(PA25)
_PA26: R95.2 U3.W16(PA26)
_PA27: R96.2 U3.W18(PA27)
_PA28: R97.2 U3.T14(PA28)
_PA29: R98.2 U3.W19(PA29)
_PA30: R270.2 U3.R14(PA30)
_PA31: R101.2 U3.W20(PA31)
_PB0: R42.2 U3.U18(PB0)
_PB1: R45.2 U3.W21(PB1)
_PB2: R47.2 U3.T21(PB2)
_PB3: R50.2 U3.V19(PB3)
_PB4: R53.2 U3.T20(PB4)
_PB5: R56.2 U3.V18(PB5)
_PB6: R59.2 U3.T19(PB6)
_PB7: R389.2 U3.V17(PB7)
_PB8: R63.2 U3.T18(PB8)
_PB9: R66.2 U3.P17(PB9)
_PB10: R69.2 U3.P15(PB10)
_PB11: R71.2 U3.G21(PB11)
_PB12: R73.2 U3.M15(PB12)
_PB13: R75.2 U3.R16(PB13)
_PB14: R77.2 U3.N14(PB14)
_PB15: R78.2 U3.N15(PB15)
_PB16: R181.2 U3.M14(PB16)
_PB17: R182.2 U3.F21(PB17)
_PB18: R85.2 U3.D21(PB18)
_PB19: U3.M13(PB19)
_PB20: R183.2 U3.J21(PB20)
_PB21: R184.2 U3.J20(PB21)
_PB22: R292.2 U3.H15(PB22)
_PB23: R294.2 U3.F19(PB23)
_PB24: R501.2 U3.G19(PB24)
_PB25: R269.2 U3.J14(PB25)
_PB26: R502.2 U3.C20(PB26)
_PB27: U3.G16(PB27)
_PB28: R93.1 R94.2 U3.G10(PB28)
_PB29: R99.2 U3.H11(PB29)
_PB30: R100.2 U3.B9(PB30)
_PB31: R102.2 U3.A13(PB31)
_PC0: R104.2 U3.A9(PC0)
_PC1: R106.2 U3.H10(PC1)
_PC2: R109.2 U3.A7(PC2)
_PC3: R108.2 R115.1 U3.G1(PC3)
_PC4: R112.2 U3.H5(PC4)
_PC5: R89.1 R90.2 U3.F2(PC5)
_PC6: R297.2 U3.K8(PC6)
_PC7: R365.2 U3.J8(PC7)
_PC8: R118.2 U3.F1(PC8)
_PC9: R120.2 U3.G2(PC9)
_PC10: R121.2 U3.M10(PC10)
_PC11: U3.K9(PC11)
_PC12: R126.2 U3.D1(PC12)
_PC13: R129.2 U3.F8(PC13)
_PC14: R131.2 U3.D6(PC14)
_PC15: R273.2 U3.H9(PC15)
_PC16: R274.2 U3.D5(PC16)
_PC17: R138.2 U3.D3(PC17)
_PC18: R140.2 U3.C4(PC18)
_PC19: R142.2 U3.G8(PC19)
_PC20: R275.2 U3.D4(PC20)
_PC21: R276.2 U3.E4(PC21)
_PC22: R386.2 U3.C3(PC22)
_PC23: R147.2 U3.F3(PC23)
_PC24: R148.2 U3.C2(PC24)
_PC30: R149.2 U3.G4(PC30)
_PC31: R151.2 U3.D2(PC31)
_PD00: R315.2 U3.G3(PD0)
_PD01: R370.2 U3.F4(PD1)
_PD02: R371.2 U3.H12(PD2)
_PD03: R372.2 U3.B15(PD3)
_PD04: R111.2 U3.A15(PD4)
_PD05: R271.2 U3.A16(PD5)
_PD06: R272.2 U3.G12(PD6)
_PD07: R116.2 U3.J11(PD7)
_PD08: R373.2 U3.B13(PD8)
_PD09: U3.D19(PD9) ; port MCP16502_INT_PD9
_PD10: R387.2 U3.M12(PD10)
_PD11: R122.2 U3.A20(PD11)
_PD12: R125.2 U3.P12(PD12)
_PD13: R127.2 U3.H18(PD13)
_PD14: R130.2 U3.C19(PD14)
_PD15: R132.2 U3.R12(PD15)
_PD16: R135.2 U3.D18(PD16)
_PD17: R137.2 U3.G18(PD17)
_PD18: R139.2 U3.B19(PD18)
_PD19: R141.2 U3.N11(PD19)
_PD20: R143.2 U3.C18(PD20)
_PD24: R503.2 U3.D17(PD24)
_PD27: R87.2 U3.D16(PD27)
_PD28: R517.2 U3.J12(PD28)
_PD29: R82.2 U3.B18(PD29)
_PD30: U3.H13(PD30)
_PD31: R150.2 U3.C16(PD31)
_PE0: R40.2 U3.E18(PE0)
_PE1: R43.2 U3.F14(PE1)
_PE2: R396.2 U3.A18(PE2)
_PE3: R48.2 U3.C15(PE3)
_PE4: R51.2 U3.D15(PE4)
_PE5: R268.2 U3.B16(PE5)
_PE6: R175.2 U3.G13(PE6)
_PE7: R178.2 U3.E14(PE7)
ADC_TEMP1: R273.1 ; off-sheet ADC_TEMP1
ADC_TEMP2: R138.1 ; off-sheet ADC_TEMP2
ADC_TEMP3: R274.1 ; off-sheet ADC_TEMP3
ADC_TEMP4: R275.1 ; off-sheet ADC_TEMP4
ADC_TEMP_1: R386.1 ; port ADC_TEMP_1
CPU_FPGA_PROGRAM_B: R315.1 ; off-sheet CPU_FPGA_PROGRAM_B
FLEX9_I2C_SCL: R142.1 ; off-sheet FLEX9_I2C_SCL
FLEX9_I2C_SDA: R140.1 ; off-sheet FLEX9_I2C_SDA
FPGA_USART_CLK: R269.1 ; off-sheet FPGA_USART_CLK
FPGA_USART_RX: R148.1 ; off-sheet FPGA_USART_RX
FPGA_USART_TX: R147.1 ; off-sheet FPGA_USART_TX
MCP16502_HPM: R78.1 R152.2 R155.1 ; off-sheet MCP16502_HPM
MIPI_1_PWR_EN: R183.1 ; off-sheet MIPI_1_PWR_EN
MIPI_1_PWR_nFAIL: R181.1 ; off-sheet MIPI_1_PWR_nFAIL
MIPI_2_PWR_EN: R184.1 ; off-sheet MIPI_2_PWR_EN
MIPI_2_PWR_nFAIL: R294.1 ; off-sheet MIPI_2_PWR_nFAIL
MPU_CANRX0: R127.1 ; off-sheet MPU_CANRX0
MPU_CANRX1: R132.1 ; off-sheet MPU_CANRX1
MPU_CANTX0: R125.1 ; off-sheet MPU_CANTX0
MPU_CANTX1: R130.1 ; off-sheet MPU_CANTX1
MPU_FPGA_IO_0: R370.1 ; off-sheet MPU_FPGA_IO_0
MPU_FPGA_IO_1: R371.1 ; off-sheet MPU_FPGA_IO_1
MPU_FPGA_IO_2: R372.1 ; off-sheet MPU_FPGA_IO_2
MPU_FPGA_IO_3: R373.1 ; off-sheet MPU_FPGA_IO_3
MPU_UART_CONSOLE_RX: R137.1 ; off-sheet MPU_UART_CONSOLE_RX
MPU_UART_CONSOLE_TX: R135.1 ; off-sheet MPU_UART_CONSOLE_TX
MPU_UART_RS422_RX: R151.1 ; off-sheet MPU_UART_RS422_RX
MPU_UART_RS422_TX: R149.1 ; off-sheet MPU_UART_RS422_TX
MPU_USB_LED: R82.1 ; off-sheet MPU_USB_LED
NTRST_PC25: C74.2 J13.6 R153.1 U3.B1(PC25)
PC104_CAM_IQR1: R271.1 ; off-sheet PC104_CAM_IQR1
PC104_CAM_IQR2: R272.1 ; off-sheet PC104_CAM_IQR2
PC104_I2C_EN: R517.1 ; off-sheet PC104_I2C_EN
PC104_I2C_IQR1: R297.1 ; off-sheet PC104_I2C_IQR1
PC104_I2C_IQR2: R276.1 ; off-sheet PC104_I2C_IQR2
PC104_SPI_IQR1: R365.1 ; off-sheet PC104_SPI_IQR1
PC104_SPI_IQR2: R387.1 ; off-sheet PC104_SPI_IQR2
POW_ONOFF_AI: R179.1 ; off-sheet POW_ONOFF_AI
POW_ONOFF_FPGA: R43.1 ; off-sheet POW_ONOFF_FPGA
RS232_1_UART_RX: R141.1 ; off-sheet RS232_1_UART_RX
RS232_1_UART_TX: R139.1 ; off-sheet RS232_1_UART_TX
RS232_2_UART_RX: R129.1 ; off-sheet RS232_2_UART_RX
RS232_2_UART_TX: R131.1 ; off-sheet RS232_2_UART_TX
SAM7_FLEX1_I2C_SCL: R121.1 ; off-sheet SAM7_FLEX1_I2C_SCL  [project net SAM_RTC_I2C_SCL]
SAM7_FLEX1_I2C_SDA: R120.1 ; off-sheet SAM7_FLEX1_I2C_SDA  [project net SAM_RTC_I2C_SDA]
SAM7_MRAM_QSPI_CLK: R77.1 ; off-sheet SAM7_MRAM_QSPI_CLK
SAM7_MRAM_QSPI_IO0: R73.1 ; off-sheet SAM7_MRAM_QSPI_IO0
SAM7_MRAM_QSPI_IO1: R71.1 ; off-sheet SAM7_MRAM_QSPI_IO1
SAM7_MRAM_QSPI_IO2: R69.1 ; off-sheet SAM7_MRAM_QSPI_IO2
SAM7_MRAM_QSPI_IO3: R66.1 ; off-sheet SAM7_MRAM_QSPI_IO3
SAM7_MRAM_QSPI_nCS: R75.1 ; off-sheet SAM7_MRAM_QSPI_nCS
SAMA7_CONF_SPI_FPGA_SEL: R87.1 ; off-sheet SAMA7_CONF_SPI_FPGA_SEL
SAMA7_CONF_SPI_MCLK: R95.1 ; off-sheet SAMA7_CONF_SPI_MCLK
SAMA7_CONF_SPI_MCSN: R96.1 ; off-sheet SAMA7_CONF_SPI_MCSN
SAMA7_CONF_SPI_MISO/MD1: R98.1 ; off-sheet SAMA7_CONF_SPI_MISO/MD1
SAMA7_CONF_SPI_MOSI/MD0: R97.1 ; off-sheet SAMA7_CONF_SPI_MOSI/MD0
SAMA7_FLASH_SPI_FPGA_SEL: R85.1 ; off-sheet SAMA7_FLASH_SPI_FPGA_SEL
SAMA7_FLASH_SPI_MCLK: R56.1 ; off-sheet SAMA7_FLASH_SPI_MCLK
SAMA7_FLASH_SPI_MCSN: R59.1 ; off-sheet SAMA7_FLASH_SPI_MCSN
SAMA7_FLASH_SPI_MISO/MD1: R53.1 ; off-sheet SAMA7_FLASH_SPI_MISO/MD1
SAMA7_FLASH_SPI_MOSI/MD0: R50.1 ; off-sheet SAMA7_FLASH_SPI_MOSI/MD0
SD2_CLK: R100.1 ; off-sheet SD2_CLK
SD2_CMD: R99.1 ; off-sheet SD2_CMD
SD2_DATA0: R102.1 ; off-sheet SD2_DATA0
SD2_DATA1: R104.1 ; off-sheet SD2_DATA1
SD2_DATA2: R106.1 ; off-sheet SD2_DATA2
SD2_DATA3: R109.1 ; off-sheet SD2_DATA3
SD2_nCD: R112.1 ; off-sheet SD2_nCD
SOM_CAM_I2C_EN1: R293.1 ; off-sheet SOM_CAM_I2C_EN1
SOM_CAM_I2C_EN2: R295.1 ; off-sheet SOM_CAM_I2C_EN2
SOM_CAM_MIPI_SEL: R292.1 ; off-sheet SOM_CAM_MIPI_SEL
SOM_EMMC_nRST: R46.1 ; off-sheet SOM_EMMC_nRST
SOM_RS422_DE: R150.1 ; off-sheet SOM_RS422_DE
SOM_RS422_~{RE}: R40.1 ; off-sheet SOM_RS422_~{RE}
SOM_SDMMC0_CD_PA14: R76.1 ; off-sheet SOM_SDMMC0_CD_PA14
SOM_SDMMC0_OUT_CK: R41.1 ; off-sheet SOM_SDMMC0_OUT_CK
SOM_SDMMC0_OUT_CMD: R44.1 ; off-sheet SOM_SDMMC0_OUT_CMD
SOM_SDMMC0_OUT_D0: R49.1 ; off-sheet SOM_SDMMC0_OUT_D0
SOM_SDMMC0_OUT_D1: R52.1 ; off-sheet SOM_SDMMC0_OUT_D1
SOM_SDMMC0_OUT_D2: R55.1 ; off-sheet SOM_SDMMC0_OUT_D2
SOM_SDMMC0_OUT_D3: R58.1 ; off-sheet SOM_SDMMC0_OUT_D3
SOM_SDMMC0_OUT_D4: R61.1 ; off-sheet SOM_SDMMC0_OUT_D4
SOM_SDMMC0_OUT_D5: R62.1 ; off-sheet SOM_SDMMC0_OUT_D5
SOM_SDMMC0_OUT_D6: R65.1 ; off-sheet SOM_SDMMC0_OUT_D6
SOM_SDMMC0_OUT_D7: R68.1 ; off-sheet SOM_SDMMC0_OUT_D7
SOM_SDMMC0_OUT_DS: R70.1 ; off-sheet SOM_SDMMC0_OUT_DS
SOM_STATUS_LED_1: R74.1 ; off-sheet SOM_STATUS_LED_1
SOM_STATUS_LED_2: R143.1 ; off-sheet SOM_STATUS_LED_2
SOM_STATUS_LED_3: R63.1 ; off-sheet SOM_STATUS_LED_3
SOM_USB_SW_nOE: R182.1 ; off-sheet SOM_USB_SW_nOE
SOM_USB_SW_SEL0: R175.1 ; off-sheet SOM_USB_SW_SEL0
SOM_USB_SW_SEL1: R178.1 ; off-sheet SOM_USB_SW_SEL1
SOM_USER_BUTTON_PA12: R72.1 ; off-sheet SOM_USER_BUTTON_PA12
TCK_SWCLK_PC26: J13.5 U3.H7(PC26)
TDI_PC28: J13.4 U3.H6(PC28)
TDO_PC29: J13.7 U3.A2(PC29)
TMS_SWDIO_PC27: J13.8 U3.C1(PC27)
USB_1_nFAULT: R389.1 ; off-sheet USB_1_nFAULT
USB_1_PWR_EN: R86.1 ; off-sheet USB_1_PWR_EN
USB_2_nFAULT: R501.1 ; off-sheet USB_2_nFAULT
USB_2_PWR_EN: R180.1 ; off-sheet USB_2_PWR_EN
USB_3_nFAULT: R502.1 ; off-sheet USB_3_nFAULT
USB_3_PWR_EN: R296.1 ; off-sheet USB_3_PWR_EN
USB_4_nFAULT: R503.1 ; off-sheet USB_4_nFAULT
USB_4_PWR_EN: R92.1 ; off-sheet USB_4_PWR_EN
NetC75_2: C75.2 R154.1 ; port NRST
NetH1_21: R42.1 ; port PC104_SPI_nCS0
NetH1_22: R270.1 ; port PC104_SPI_nCS1
NetH1_23: R101.1 ; port PC104_SPI_CLK
NetH1_25: R47.1 ; port PC104_SPI_MOSI
NetH1_27: R45.1 ; port PC104_SPI_MISO
NetR7_2: R118.1 ; port PAC1934_INT_PC8
NetR48_1: R48.1 ; port SAM_STX_RS485_UART_TX
NetR51_1: R51.1 ; port SAM_STX_RS485_UART_RX
NetR64_1: R64.1 ; port RTC_INT
NetR64_2: R64.2 U3.AA19(PIOBU0)
NetR67_1: R67.1 ; port WD_WAKEUP
NetR67_2: R67.2 U3.P9(PIOBU1)
NetR79_2: R396.1 ; port PAC1934_INT_PE2
NetR111_1: R111.1 ; port WD_DONE
NetR116_1: R116.1 ; port RTC_CLOCK
NetR119_2: R119.2 R122.1 R128.1
NetR123_2: R123.2 R126.1 R133.1
NetR226_2: R268.1 ; port SAM_RS485_DE_~{RE}

Not connected (* = marked no-connect by the designer): J13 1; U3 A19(PD22)* AA18(PIOBU2)* F18(PD21)* G14(PD26) K10(PD25)* K12(PD23)* P10(PIOBU3)*

### Notes on the sheet
- [ver 1.1.0] Use SAMA7G54 instead
- SAMA7G5 Bus Distribution
- FLEXCOM6_MOSI
- FLEXCOM6_MISO
- FLEXCOM6_nCS0
- FLEXCOM11_MOSI
- FLEXCOM0 RX
- FLEXCOM0 TX
- FLEXCOM11_SPCK
- FLEXCOM11_NPCS1
- FLEXCOM11_MISO
- WAKEUP2
- (near R403) PULL DOWN FOR DS
- WAKEUP3
- FLEXCOM5_SPCK
- FLEXCOM5_NPCS0
- FLEXCOM5_MOSI
- SDMMC1 Reset Signal
- FLEXCOM7_CLK
- FLEXCOM6_SPCK
- FLEXCOM6_nCS1
- FLEXCOM5_MISO
- SDMMC1 Command Line
- SDMMC1 Data 0 Line
- SDMMC1 Clock Line
- SDMMC1 Data 1 Line
- SDMMC1 Data 2 Line
- SDMMC1 Data 3 Line
- SPI:4
- F5:
- F6:
- SPI SW EEPROM
- PC104
- SDMMC1 Write Protect Signal
- SDMMC1 Card Detect
- SDMMC1 1.8V/3.3V Selection
- TCLK1
- TCLK0
- F11:
- SPI SW FLASH
- FLEXCOM1 TWD/SDA
- FLEXCOM1 TWCK/SCL
- USBB_VBUS_DETECT_EMMC
- CAN0_TX
- CAN0_RX
- UART:6
- F0:
- F3:
- RS485
- CONSOLE
- FLEXCOM8_RX
- FLEXCOM8_TX
- AD2
- AD3
- AD4
- FLEXCOM3_RX
- FLEXCOM3_TX
- FLEXCOM4_TX
- CAN1_TX
- CAN1_RX
- F10:
- F4:
- F8:
- RS422
- FLEXCOM9_TWD/SDA
- FLEXCOM9_TWCK/SCL
- AD9
- AD7
- FLEXCOM4_RX
- F7:
- FPGA
- FLEXCOM7_TX
- FLEXCOM7_RX
- I2C:2
- F1:
- F9:
- RTC+2xPMIC
- FLEXCOM10_TX
- FLEXCOM10_RX
- [ver 1.1.0] Change Flexcom
- Project:
- Sub-system:
- Design by:
- Sheet title:
- Sheet
- of
- Checked by:
- Approved by:
- Revision:
- Document No:
- Size:
- Date:
- A3

### Library data of the parts
C74 C75 = _CAP_C_2: CAP
R40-R53 R55 R56 R58 R59 R61-R78 R80#2 R81#2 R82 R85-R87 R89 R90 R92-R102 R104 R106 R108 R109 R111 R112 R115 R116 R118-R123 R125-R133 R135 R137-R143 R147-R155 R175 R178-R184 R268-R276 R292-R297 R315 R365 R370-R373 R386 R387 R389 R396 R403 R501-R503 R517 = _RES_B_2: RES
U3 = SAMA7G54: as U3 on sheet SAMA7G54_MPU; Package: TFBGA-343; Value: SAMA7G54; Type: 32-Bit MPU; Status: MCL Design; Revision: 1; Category: MCHP-Microcontroller; ComponentLink1Description: SVN Datasheet; ComponentLink2Description: Local Datasheet; ComponentLink3URL: C:\ALTIUM_WORK\00001_MCHP-CDB\Library\LibraryRefs\SAMA7G54 TFBGA-343.SchLib; ComponentLink3Description: Open Symbol; ComponentLink4URL: C:\ALTIUM_WORK\00001_MCHP-CDB\Library\Footprints\TFBGA-343_14x14.PcbLib; ComponentLink4Description: Open Footprint; ComponentLink5Description: Open Footprint 2; ComponentLink6Description: Open Footprint 3; ComponentLink7Description: Open Footprint 4; Supplier 1: Microchip; Supplier Part Number 1: SAMA7G54-V/4HB; Quantity Override: 1

## Sheet SAMA7G54_DDR3L.SchDoc
size 420 x 297 mm; SheetNumber: 12; SheetTotal: 34
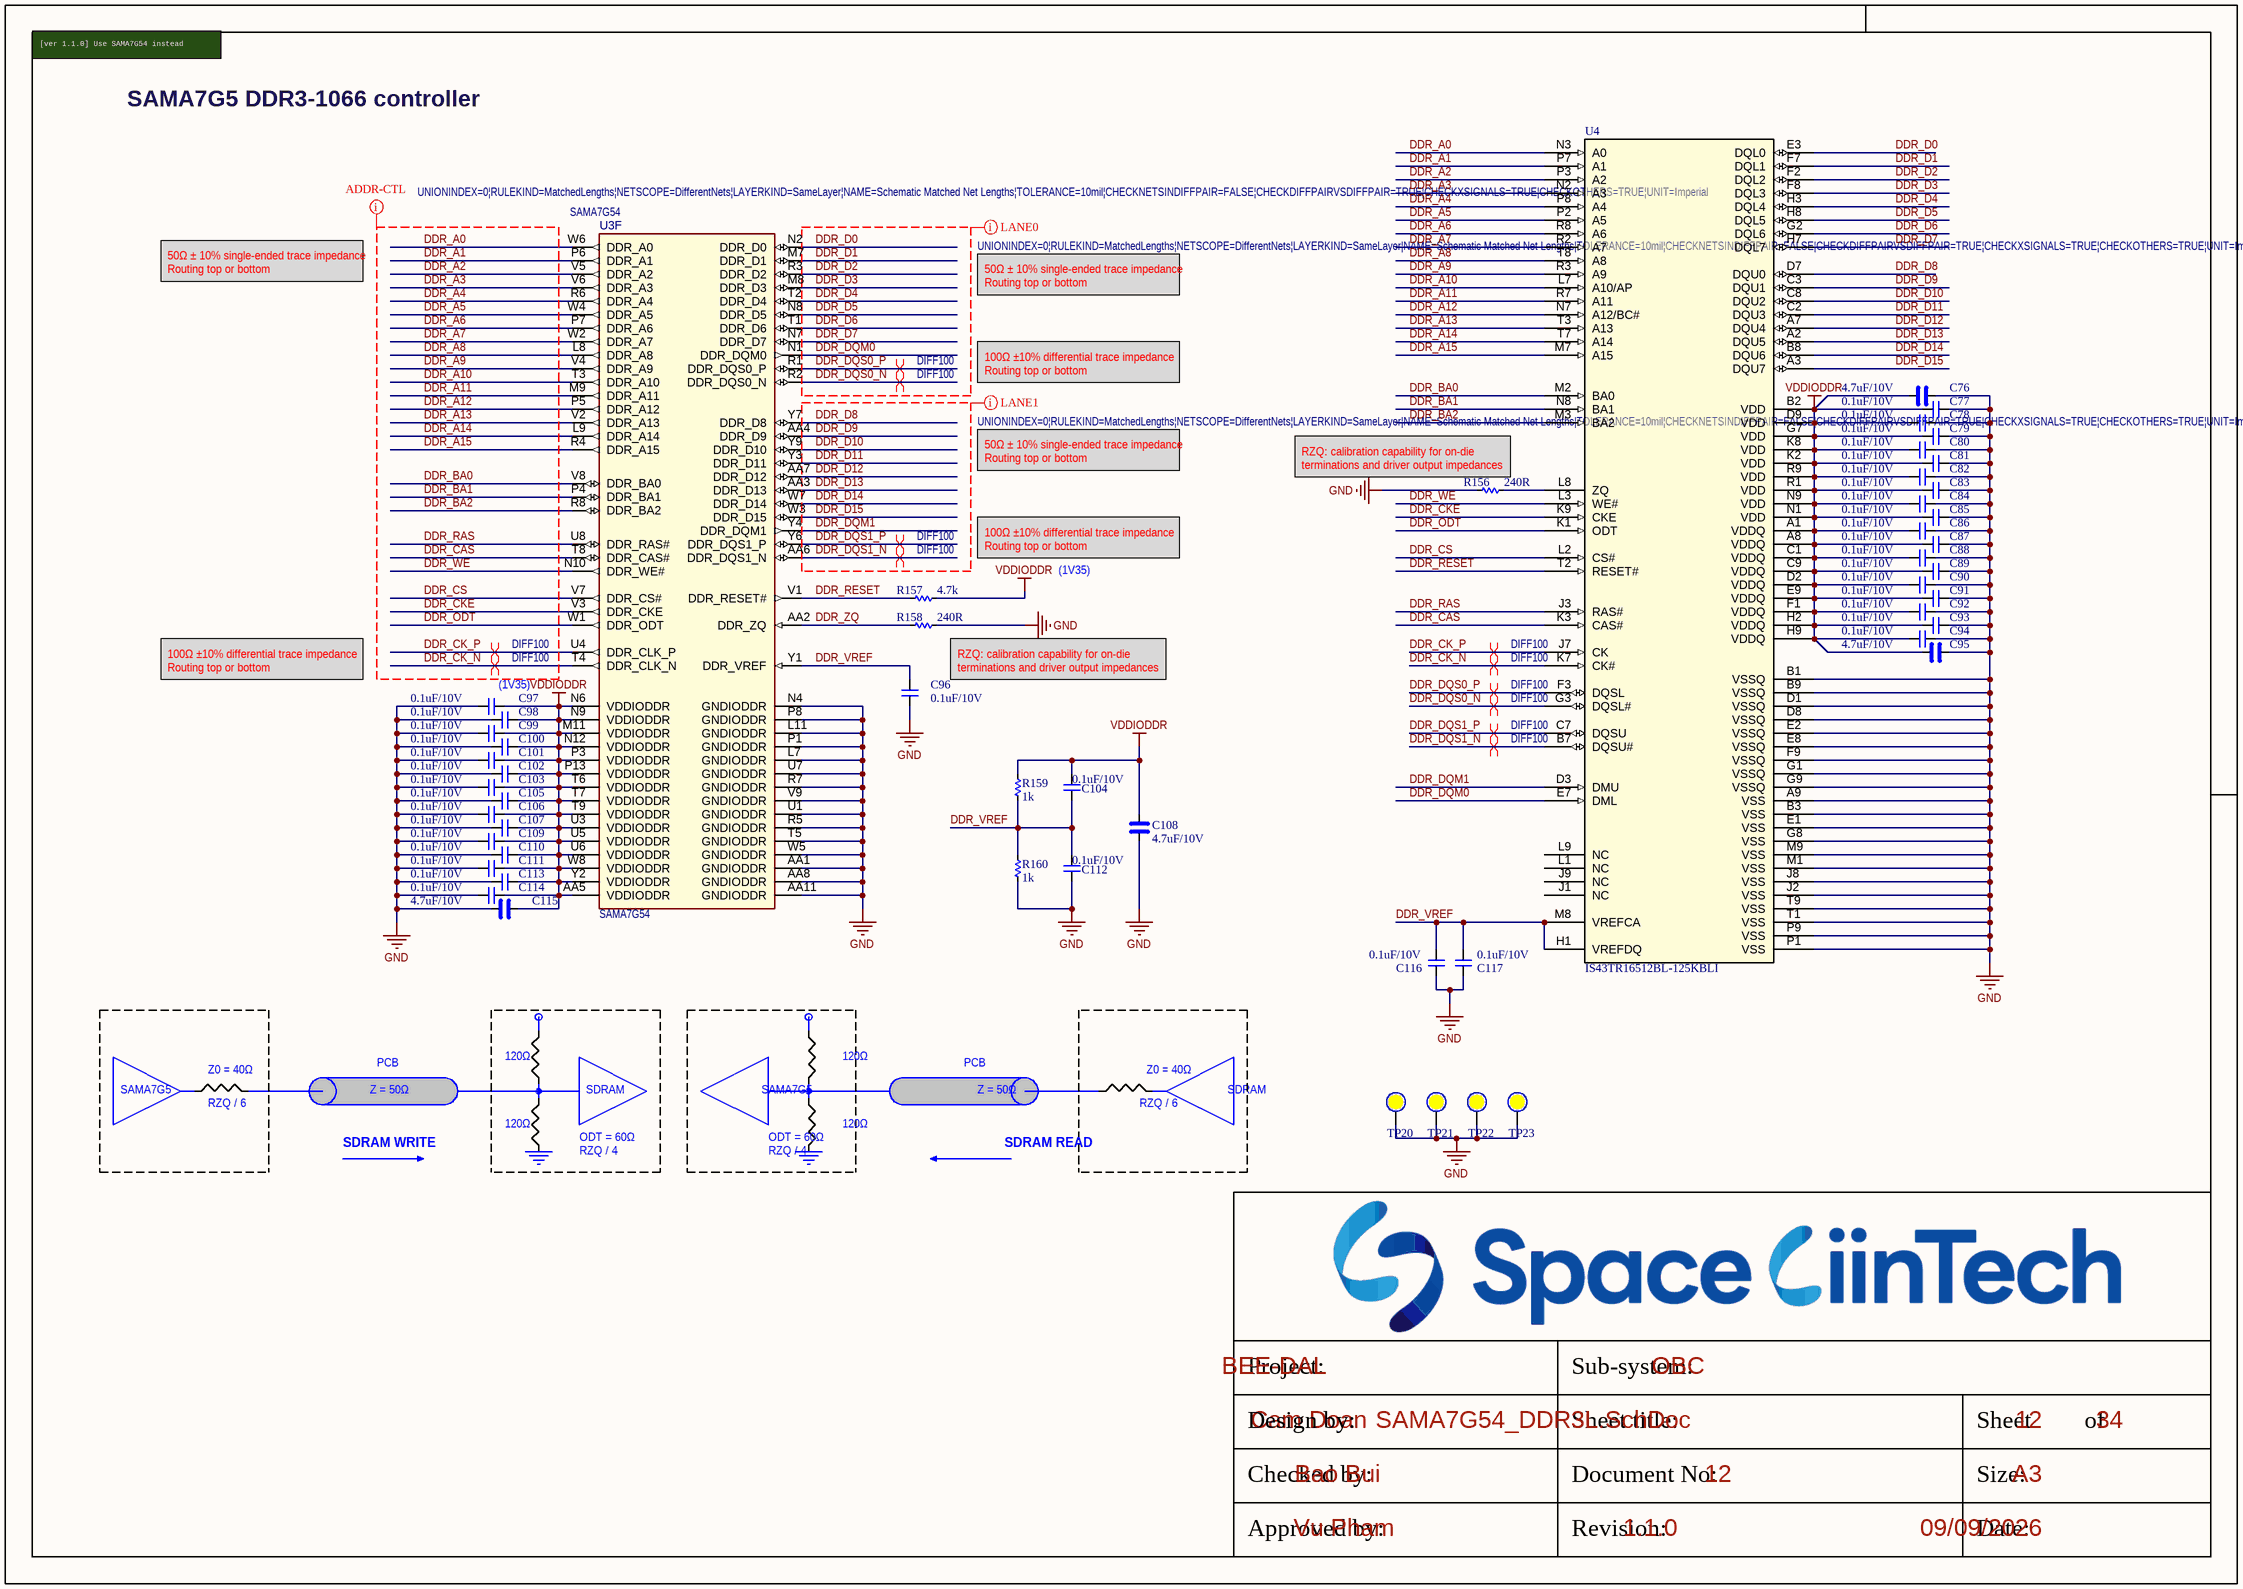
[diagram p11: SAMA7G54_DDR3L.SchDoc]

### Parts
C76  4.7uF/10V  [CAP_C_1005X50_L]
C77  0.1uF/10V  [CAP_C_0603x30]
C78  0.1uF/10V  [CAP_C_0603x30]
C79  0.1uF/10V  [CAP_C_0603x30]
C80  0.1uF/10V  [CAP_C_0603x30]
C81  0.1uF/10V  [CAP_C_0603x30]
C82  0.1uF/10V  [CAP_C_0603x30]
C83  0.1uF/10V  [CAP_C_0603x30]
C84  0.1uF/10V  [CAP_C_0603x30]
C85  0.1uF/10V  [CAP_C_0603x30]
C86  0.1uF/10V  [CAP_C_0603x30]
C87  0.1uF/10V  [CAP_C_0603x30]
C88  0.1uF/10V  [CAP_C_0603x30]
C89  0.1uF/10V  [CAP_C_0603x30]
C90  0.1uF/10V  [CAP_C_0603x30]
C91  0.1uF/10V  [CAP_C_0603x30]
C92  0.1uF/10V  [CAP_C_0603x30]
C93  0.1uF/10V  [CAP_C_0603x30]
C94  0.1uF/10V  [CAP_C_0603x30]
C95  4.7uF/10V  [CAP_C_1005X50_L]
C96  0.1uF/10V  [CAP_C_0603x30]
C97  0.1uF/10V  [CAP_C_0603x30]
C98  0.1uF/10V  [CAP_C_0603x30]
C99  0.1uF/10V  [CAP_C_0603x30]
C100  0.1uF/10V  [CAP_C_0603x30]
C101  0.1uF/10V  [CAP_C_0603x30]
C102  0.1uF/10V  [CAP_C_0603x30]
C103  0.1uF/10V  [CAP_C_0603x30]
C104  0.1uF/10V  [CAP_C_0603x30]
C105  0.1uF/10V  [CAP_C_0603x30]
C106  0.1uF/10V  [CAP_C_0603x30]
C107  0.1uF/10V  [CAP_C_0603x30]
C108  4.7uF/10V  [CAP_C_1005X50_L]
C109  0.1uF/10V  [CAP_C_0603x30]
C110  0.1uF/10V  [CAP_C_0603x30]
C111  0.1uF/10V  [CAP_C_0603x30]
C112  0.1uF/10V  [CAP_C_0603x30]
C113  0.1uF/10V  [CAP_C_0603x30]
C114  0.1uF/10V  [CAP_C_0603x30]
C115  4.7uF/10V  [CAP_C_1005X50_L]
C116  0.1uF/10V  [CAP_C_0603x30]
C117  0.1uF/10V  [CAP_C_0603x30]
R156  240R  [RES_C_0603X30]
R157  4.7k  [RES_C_1005x30_L]
R158  240R  [RES_C_0603X30]
R159  1k  [RES_C_1005x30_L]
R160  1k  [RES_C_1005x30_L]
TP20  (no value)  [Testpoint_80_pin0]  (no BOM)
TP21  (no value)  [Testpoint_80_pin0]  (no BOM)
TP22  (no value)  [Testpoint_80_pin0]  (no BOM)
TP23  (no value)  [Testpoint_80_pin0]  (no BOM)
U3  SAMA7G54  [TFBGA-343_14x14 - 2.5mm]  (part F of 8)
U4  IS43TR16512BL-125KBLI  [TWBGA96_ISI]

### Nets
GND: C76.1 C77.1 C78.1 C79.1 C80.1 C81.1 C82.1 C83.1 C84.1 C85.1 C86.1 C87.1 C88.1 C89.1 C90.1 C91.1 C92.1 C93.1 C94.1 C95.1 C96.2 C97.2 C98.2 C99.2 C100.2 C101.2 C102.2 C103.2 C105.2 C106.2 C107.2 C108.2 C109.2 C110.2 C111.2 C112.2 C113.2 C114.2 C115.2 C116.2 C117.2 R156.2 R158.1 R160.2 TP20.0 TP21.0 TP22.0 TP23.0 U3.AA1(GNDIODDR) U3.AA8(GNDIODDR) U3.AA11(GNDIODDR) U3.L7(GNDIODDR) U3.L11(GNDIODDR) U3.N4(GNDIODDR) U3.P1(GNDIODDR) U3.P8(GNDIODDR) U3.R5(GNDIODDR) U3.R7(GNDIODDR) U3.T5(GNDIODDR) U3.U1(GNDIODDR) U3.U7(GNDIODDR) U3.V9(GNDIODDR) U3.W5(GNDIODDR) U4.A9(VSS) U4.B1(VSSQ) U4.B3(VSS) U4.B9(VSSQ) U4.D1(VSSQ) U4.D8(VSSQ) U4.E1(VSS) U4.E2(VSSQ) U4.E8(VSSQ) U4.F9(VSSQ) U4.G1(VSSQ) U4.G8(VSS) U4.G9(VSSQ) U4.J2(VSS) U4.J8(VSS) U4.M1(VSS) U4.M9(VSS) U4.P1(VSS) U4.P9(VSS) U4.T1(VSS) U4.T9(VSS)  [project net AGND]
VDDIODDR: C76.2 C77.2 C78.2 C79.2 C80.2 C81.2 C82.2 C83.2 C84.2 C85.2 C86.2 C87.2 C88.2 C89.2 C90.2 C91.2 C92.2 C93.2 C94.2 C95.2 C97.1 C98.1 C99.1 C100.1 C101.1 C102.1 C103.1 C104.1 C105.1 C106.1 C107.1 C108.1 C109.1 C110.1 C111.1 C113.1 C114.1 C115.1 R157.1 R159.1 U3.AA5(VDDIODDR) U3.M11(VDDIODDR) U3.N6(VDDIODDR) U3.N9(VDDIODDR) U3.N12(VDDIODDR) U3.P3(VDDIODDR) U3.P13(VDDIODDR) U3.T6(VDDIODDR) U3.T7(VDDIODDR) U3.T9(VDDIODDR) U3.U3(VDDIODDR) U3.U5(VDDIODDR) U3.U6(VDDIODDR) U3.W8(VDDIODDR) U3.Y2(VDDIODDR) U4.A1(VDDQ) U4.A8(VDDQ) U4.B2(VDD) U4.C1(VDDQ) U4.C9(VDDQ) U4.D2(VDDQ) U4.D9(VDD) U4.E9(VDDQ) U4.F1(VDDQ) U4.G7(VDD) U4.H2(VDDQ) U4.H9(VDDQ) U4.K2(VDD) U4.K8(VDD) U4.N1(VDD) U4.N9(VDD) U4.R1(VDD) U4.R9(VDD)
DDR_A0: U3.W6(DDR_A0) U4.N3(A0)
DDR_A1: U3.P6(DDR_A1) U4.P7(A1)
DDR_A2: U3.V5(DDR_A2) U4.P3(A2)
DDR_A3: U3.V6(DDR_A3) U4.N2(A3)
DDR_A4: U3.R6(DDR_A4) U4.P8(A4)
DDR_A5: U3.W4(DDR_A5) U4.P2(A5)
DDR_A6: U3.P7(DDR_A6) U4.R8(A6)
DDR_A7: U3.W2(DDR_A7) U4.R2(A7)
DDR_A8: U3.L8(DDR_A8) U4.T8(A8)
DDR_A9: U3.V4(DDR_A9) U4.R3(A9)
DDR_A10: U3.T3(DDR_A10) U4.L7(A10/AP)
DDR_A11: U3.M9(DDR_A11) U4.R7(A11)
DDR_A12: U3.P5(DDR_A12) U4.N7(A12/BC#)
DDR_A13: U3.V2(DDR_A13) U4.T3(A13)
DDR_A14: U3.L9(DDR_A14) U4.T7(A14)
DDR_A15: U3.R4(DDR_A15) U4.M7(A15)
DDR_BA0: U3.V8(DDR_BA0) U4.M2(BA0)
DDR_BA1: U3.P4(DDR_BA1) U4.N8(BA1)
DDR_BA2: U3.R8(DDR_BA2) U4.M3(BA2)
DDR_CAS: U3.T8(DDR_CAS#) U4.K3(CAS#)
DDR_CK_N: U3.T4(DDR_CLK_N) U4.K7(CK#)
DDR_CK_P: U3.U4(DDR_CLK_P) U4.J7(CK)
DDR_CKE: U3.V3(DDR_CKE) U4.K9(CKE)
DDR_CS: U3.V7(DDR_CS#) U4.L2(CS#)
DDR_D0: U3.N2(DDR_D0) U4.E3(DQL0)
DDR_D1: U3.M7(DDR_D1) U4.F7(DQL1)
DDR_D2: U3.R3(DDR_D2) U4.F2(DQL2)
DDR_D3: U3.M8(DDR_D3) U4.F8(DQL3)
DDR_D4: U3.T2(DDR_D4) U4.H3(DQL4)
DDR_D5: U3.N8(DDR_D5) U4.H8(DQL5)
DDR_D6: U3.T1(DDR_D6) U4.G2(DQL6)
DDR_D7: U3.N7(DDR_D7) U4.H7(DQL7)
DDR_D8: U3.Y7(DDR_D8) U4.D7(DQU0)
DDR_D9: U3.AA4(DDR_D9) U4.C3(DQU1)
DDR_D10: U3.Y9(DDR_D10) U4.C8(DQU2)
DDR_D11: U3.Y3(DDR_D11) U4.C2(DQU3)
DDR_D12: U3.AA7(DDR_D12) U4.A7(DQU4)
DDR_D13: U3.AA3(DDR_D13) U4.A2(DQU5)
DDR_D14: U3.W7(DDR_D14) U4.B8(DQU6)
DDR_D15: U3.W3(DDR_D15) U4.A3(DQU7)
DDR_DQM0: U3.N1(DDR_DQM0) U4.E7(DML)
DDR_DQM1: U3.Y4(DDR_DQM1) U4.D3(DMU)
DDR_DQS0_N: U3.R2(DDR_DQS0_N) U4.G3(DQSL#)
DDR_DQS0_P: U3.R1(DDR_DQS0_P) U4.F3(DQSL)
DDR_DQS1_N: U3.AA6(DDR_DQS1_N) U4.B7(DQSU#)
DDR_DQS1_P: U3.Y6(DDR_DQS1_P) U4.C7(DQSU)
DDR_ODT: U3.W1(DDR_ODT) U4.K1(ODT)
DDR_RAS: U3.U8(DDR_RAS#) U4.J3(RAS#)
DDR_RESET: R157.2 U3.V1(DDR_RESET#) U4.T2(RESET#)
DDR_VREF: C96.1 C104.2 C112.1 C116.1 C117.1 R159.2 R160.1 U3.Y1(DDR_VREF) U4.H1(VREFDQ) U4.M8(VREFCA)
DDR_WE: U3.N10(DDR_WE#) U4.L3(WE#)
DDR_ZQ: R158.2 U3.AA2(DDR_ZQ)
NetR156_1: R156.1 U4.L8(ZQ)

Not connected (* = marked no-connect by the designer): U4 J1(NC) J9(NC) L1(NC) L9(NC)

### Layout directives
net class DDR-LANE0; rule Matched Net Lengths [Tolerance = 10mil]: DDR_D0, DDR_D1, DDR_D2, DDR_D3, DDR_D4, DDR_D5, DDR_D6, DDR_D7, DDR_DQM0, DDR_DQS0_N, DDR_DQS0_P
net class DDR-LANE1; rule Matched Net Lengths [Tolerance = 10mil]: DDR_D8, DDR_D9, DDR_D10, DDR_D11, DDR_D12, DDR_D13, DDR_D14, DDR_D15, DDR_DQM1, DDR_DQS1_N, DDR_DQS1_P
net class DDR-ADDR-CTL; rule Matched Net Lengths [Tolerance = 10mil]: DDR_A0, DDR_A1, DDR_A2, DDR_A3, DDR_A4, DDR_A5, DDR_A6, DDR_A7, DDR_A8, DDR_A9, DDR_A10, DDR_A11, DDR_A12, DDR_A13, DDR_A14, DDR_A15, DDR_BA0, DDR_BA1, DDR_BA2, DDR_CAS, DDR_CK_N, DDR_CK_P, DDR_CKE, DDR_CS, DDR_ODT, DDR_RAS, DDR_WE
differential pair; differential pair class DIFF100; net class DIFF100; rule Matched Net Lengths [Tolerance = 4mil]: DDR_CK_N, DDR_CK_P, DDR_DQS0_N, DDR_DQS0_P, DDR_DQS1_N, DDR_DQS1_P

### Notes on the sheet
- [ver 1.1.0] Use SAMA7G54 instead
- SAMA7G5 DDR3-1066 controller
- 50Ω ± 10% single-ended trace impedance
  Routing top or bottom
- 100Ω ±10% differential trace impedance
  Routing top or bottom
- (near R156) RZQ: calibration capability for on-die terminations and driver output impedances
- (1V35)
- (near C97) (1V35)
- (near R158) RZQ: calibration capability for on-die terminations and driver output impedances
- Z0 = 40Ω
- PCB
- 120Ω
- SAMA7G5
- RZQ / 6
- Z = 50Ω
- SDRAM
- SDRAM WRITE
- ODT = 60Ω
- RZQ / 4
- SDRAM READ
- Project:
- Sub-system:
- Design by:
- Sheet title:
- Sheet
- of
- Checked by:
- Approved by:
- Revision:
- Document No:
- Size:
- Date:
- A3

### Library data of the parts
C76 C95 C108 C115 = _CAP_C_High_2: CAP
C77-C94 C96-C107 C109-C114 C116 C117 = _CAP_C_2: CAP
R156-R160 = _RES_B_2: RES
TP20-TP23 = Test Point: Solder: NF
U3 = SAMA7G54: as U3 on sheet SAMA7G54_MPU; Package: TFBGA-343; Value: SAMA7G54; Type: 32-Bit MPU; Status: MCL Design; Revision: 1; Category: MCHP-Microcontroller; ComponentLink1Description: SVN Datasheet; ComponentLink2Description: Local Datasheet; ComponentLink3URL: C:\ALTIUM_WORK\00001_MCHP-CDB\Library\LibraryRefs\SAMA7G54 TFBGA-343.SchLib; ComponentLink3Description: Open Symbol; ComponentLink4URL: C:\ALTIUM_WORK\00001_MCHP-CDB\Library\Footprints\TFBGA-343_14x14.PcbLib; ComponentLink4Description: Open Footprint; ComponentLink5Description: Open Footprint 2; ComponentLink6Description: Open Footprint 3; ComponentLink7Description: Open Footprint 4; Supplier 1: Microchip; Supplier Part Number 1: SAMA7G54-V/4HB; Quantity Override: 1
U4 = IC_RAM_IS43TR16512BL-125KBLI: DDR3L; Manufacturer_Name: ISSI; Copyright: Copyright (C) 2025 Ultra Librarian. All rights reserved.; Manufacturer_Part_Number: IS43TR16512BL-125KBLI; RefDes: RefDes; Type: Type

## Sheet SDCARD_MRAM.SchDoc
size 420 x 297 mm; SheetNumber: 13; SheetTotal: 34
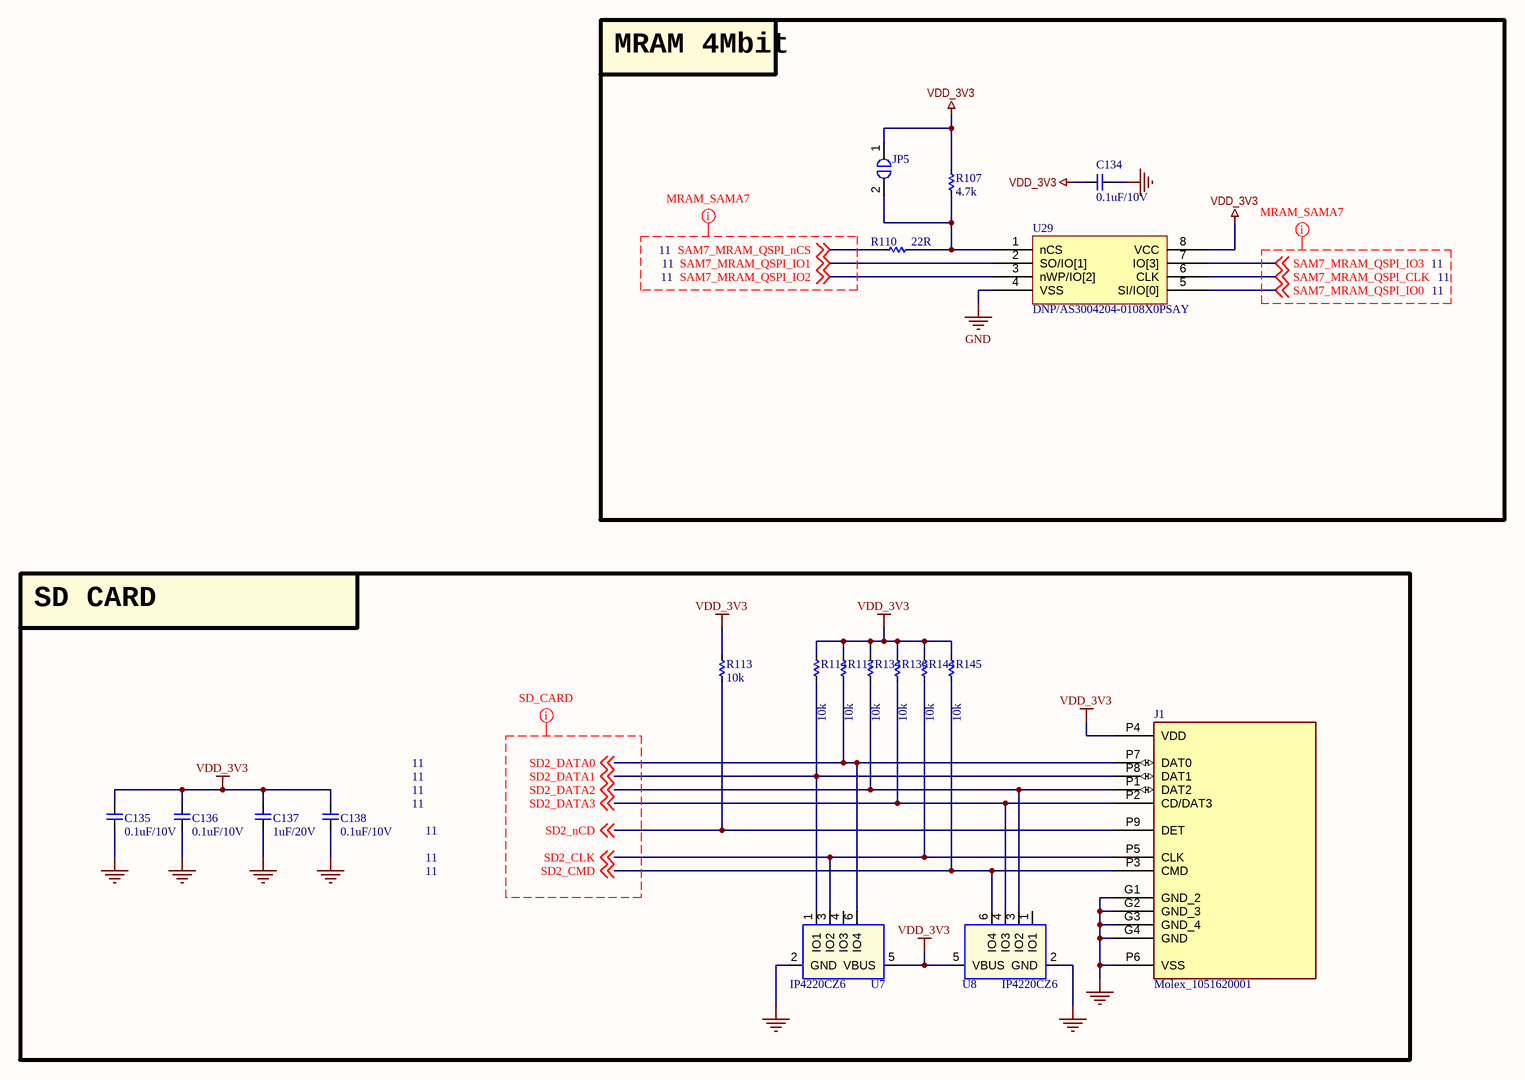
[diagram p12: SDCARD_MRAM.SchDoc]

### Parts
C134  0.1uF/10V  [CAP_C_1005X50_L]
C135  0.1uF/10V  [CAP_C_1005X50_L]
C136  0.1uF/10V  [CAP_C_1005X50_L]
C137  1uF/20V  [CAP_C_1005X50_L]
C138  0.1uF/10V  [CAP_C_1005X50_L]
J1  Molex_1051620001  [Molex_1051620001]
JP5  (no value)  [JUMPER_1608]
R107  4.7k  [RES_C_1005x30_L]
R110  22R  [RES_C_1005x30_L]
R113  10k  [RES_C_1005x30_L]
R114  10k  [RES_C_1005x30_L]
R117  10k  [RES_C_1005x30_L]
R134  10k  [RES_C_1005x30_L]
R136  10k  [RES_C_1005x30_L]
R144  10k  [RES_C_1005x30_L]
R145  10k  [RES_C_1005x30_L]
U7  IP4220CZ6  [SOT95P280X145-6N]
U8  IP4220CZ6  [SOT95P280X145-6N]
U29  DNP/AS3004204-0108X0PSAY  [SOIC127P790X216-8]

### Blocks framed on the sheet
MRAM 4Mbit: C134 JP5 R107 R110 U29
SD CARD: C135-C138 J1 R113 R114 R117 R134 R136 R144 R145 U7 U8

### Nets
GND: C134.1 C135.1 C136.1 C137.1 C138.1 J1.G1(GND_2) J1.G2(GND_3) J1.G3(GND_4) J1.G4(GND) J1.P6(VSS) U7.2(GND) U8.2(GND) U29.4(VSS)  [project net AGND]
VDD_3V3: C134.2 C135.2 C136.2 C137.2 C138.2 J1.P4(VDD) JP5.1 R107.2 R113.2 R114.2 R117.2 R134.2 R136.2 R144.2 R145.2 U7.5(VBUS) U8.5(VBUS) U29.8(VCC)
SAM7_MRAM_QSPI_CLK: U29.6(CLK) ; off-sheet SAM7_MRAM_QSPI_CLK
SAM7_MRAM_QSPI_IO0: U29.5(SI/IO[0]) ; off-sheet SAM7_MRAM_QSPI_IO0
SAM7_MRAM_QSPI_IO1: U29.2(SO/IO[1]) ; off-sheet SAM7_MRAM_QSPI_IO1
SAM7_MRAM_QSPI_IO2: U29.3(nWP/IO[2]) ; off-sheet SAM7_MRAM_QSPI_IO2
SAM7_MRAM_QSPI_IO3: U29.7(IO[3]) ; off-sheet SAM7_MRAM_QSPI_IO3
SAM7_MRAM_QSPI_nCS: R110.1 ; off-sheet SAM7_MRAM_QSPI_nCS
SD2_CLK: J1.P5(CLK) R144.1 U7.3(IO2) ; off-sheet SD2_CLK
SD2_CMD: J1.P3(CMD) R145.1 U8.6(IO4) ; off-sheet SD2_CMD
SD2_DATA0: J1.P7(DAT0) R117.1 U7.6(IO4) ; off-sheet SD2_DATA0
SD2_DATA1: J1.P8(DAT1) R114.1 U7.1(IO1) ; off-sheet SD2_DATA1
SD2_DATA2: J1.P1(DAT2) R134.1 U8.3(IO2) ; off-sheet SD2_DATA2
SD2_DATA3: J1.P2(CD/DAT3) R136.1 U8.4(IO3) ; off-sheet SD2_DATA3
SD2_nCD: J1.P9(DET) R113.1 ; off-sheet SD2_nCD
NetJP5_2: JP5.2 R107.1 R110.2 U29.1(nCS)

Not connected (* = marked no-connect by the designer): U7 4(IO3); U8 1(IO1)

### Layout directives
net class MRAM_SAMA7: SAM7_MRAM_QSPI_CLK, SAM7_MRAM_QSPI_IO0, SAM7_MRAM_QSPI_IO1, SAM7_MRAM_QSPI_IO2, SAM7_MRAM_QSPI_IO3, SAM7_MRAM_QSPI_nCS
net class SD_CARD: SD2_CLK, SD2_CMD, SD2_DATA0, SD2_DATA1, SD2_DATA2, SD2_DATA3, SD2_nCD

### Notes on the sheet
- Project:
- Sub-system:
- Design by:
- Sheet title:
- Sheet
- of
- Checked by:
- Approved by:
- Revision:
- Document No:
- Size:
- Date:
- A3

### Library data of the parts
C134-C136 C138 = _CAP_C_2: CAP
C137 = _CAP_C_2: CAP CHIP
J1 = Molex_1051620001: 9 (8 + 1) Position Card Connector Secure Digital - microSDâ„¢ Surface Mount, Right Angle Gold; MF: Molex; SnapEDA_Link: https://www.snapeda.com/parts/1051620001/Molex/view-part/?ref=snap; Package: None; Value: *; MP: 1051620001; Check_prices: https://www.snapeda.com/parts/1051620001/Molex/view-part/?ref=eda
JP5 = JUMPER_1_1
R107 R110 R113 R114 R117 R134 R136 R144 R145 = _RES_B_2: RES
U7 U8 = IP4220CZ6_0: P/N: 132D42200S; PCB Footprint: SOT23-6L; CLABCONF0: =SB-UCMIMX93
U29 = IC_RAM_AS3004204-0108X0PSAY

## Sheet eMMC.SchDoc
size 420 x 297 mm; SheetNumber: 14; SheetTotal: 34
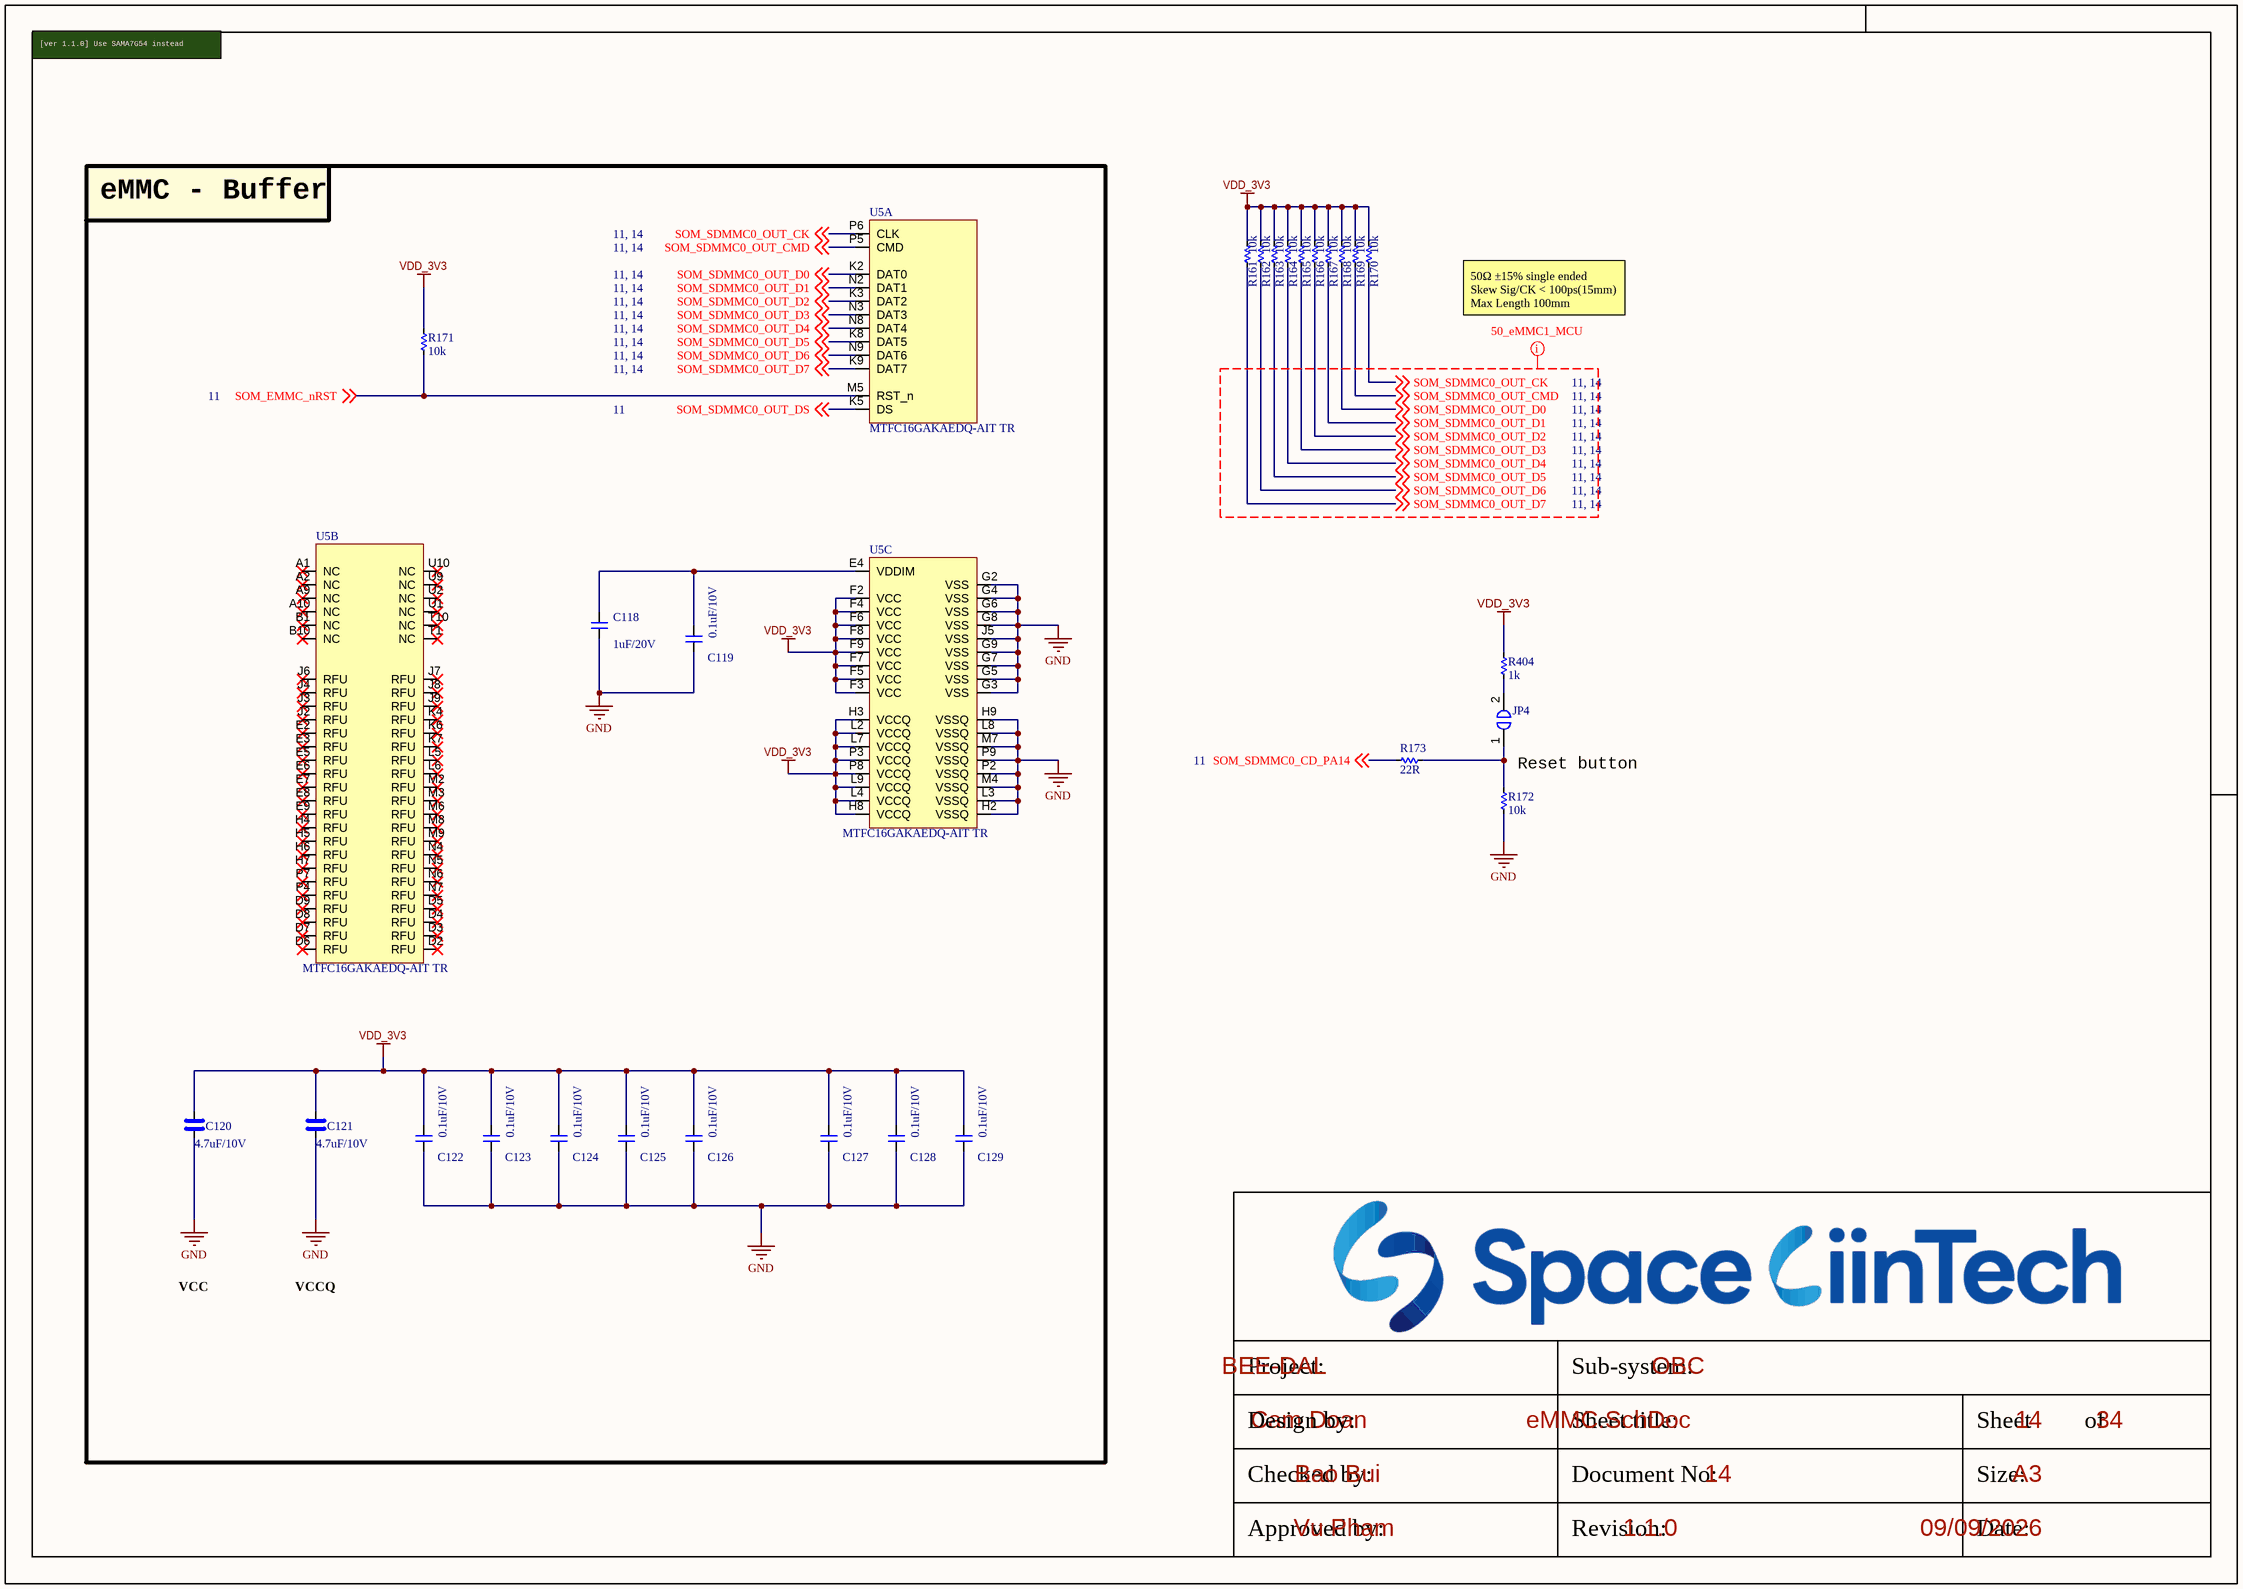
[diagram p13: eMMC.SchDoc]

### Parts
C118  1uF/20V  [CAP_C_1005X50_L]
C119  0.1uF/10V  [CAP_C_1005X50_L]
C120  4.7uF/10V  [CAP_C_1005X50_L]
C121  4.7uF/10V  [CAP_C_1005X50_L]
C122  0.1uF/10V  [CAP_C_1005X50_L]
C123  0.1uF/10V  [CAP_C_1005X50_L]
C124  0.1uF/10V  [CAP_C_1005X50_L]
C125  0.1uF/10V  [CAP_C_1005X50_L]
C126  0.1uF/10V  [CAP_C_1005X50_L]
C127  0.1uF/10V  [CAP_C_1005X50_L]
C128  0.1uF/10V  [CAP_C_1005X50_L]
C129  0.1uF/10V  [CAP_C_1005X50_L]
JP4  (no value)  [JUMPER_1608]
R161  10k  [RES_C_1005x30_L]
R162  10k  [RES_C_1005x30_L]
R163  10k  [RES_C_1005x30_L]
R164  10k  [RES_C_1005x30_L]
R165  10k  [RES_C_1005x30_L]
R166  10k  [RES_C_1005x30_L]
R167  10k  [RES_C_1005x30_L]
R168  10k  [RES_C_1005x30_L]
R169  10k  [RES_C_1005x30_L]
R170  10k  [RES_C_1005x30_L]
R171  10k  [RES_C_1005x30_L]
R172  10k  [RES_C_1005x30_L]
R173  22R  [RES_C_1005x30_L]
R404  1k  [RES_C_1005x30_L]
U5  MTFC16GAKAEDQ-AIT TR  [BGA_100_C_100P_10X17_1400X1800X150]  (parts A,B,C of 3)

### Blocks framed on the sheet
eMMC - Buffer: C118-C129 R171 U5

### Nets
GND: C118.1 C119.1 C120.1 C121.1 C122.1 C123.1 C124.1 C125.1 C126.1 C127.1 C128.1 C129.1 R172.1 U5.G2(VSS) U5.G3(VSS) U5.G4(VSS) U5.G5(VSS) U5.G6(VSS) U5.G7(VSS) U5.G8(VSS) U5.G9(VSS) U5.H2(VSSQ) U5.H9(VSSQ) U5.J5(VSS) U5.L3(VSSQ) U5.L8(VSSQ) U5.M4(VSSQ) U5.M7(VSSQ) U5.P2(VSSQ) U5.P9(VSSQ)  [project net AGND]
VDD_3V3: C120.2 C121.2 C122.2 C123.2 C124.2 C125.2 C126.2 C127.2 C128.2 C129.2 R161.2 R162.2 R163.2 R164.2 R165.2 R166.2 R167.2 R168.2 R169.2 R170.2 R171.2 R404.2 U5.F2(VCC) U5.F3(VCC) U5.F4(VCC) U5.F5(VCC) U5.F6(VCC) U5.F7(VCC) U5.F8(VCC) U5.F9(VCC) U5.H3(VCCQ) U5.H8(VCCQ) U5.L2(VCCQ) U5.L4(VCCQ) U5.L7(VCCQ) U5.L9(VCCQ) U5.P3(VCCQ) U5.P8(VCCQ)
SOM_EMMC_nRST: R171.1 U5.M5(RST_n) ; off-sheet SOM_EMMC_nRST
SOM_SDMMC0_CD_PA14: R173.1 ; off-sheet SOM_SDMMC0_CD_PA14
SOM_SDMMC0_OUT_CK: R170.1 U5.P6(CLK) ; off-sheet SOM_SDMMC0_OUT_CK
SOM_SDMMC0_OUT_CMD: R169.1 U5.P5(CMD) ; off-sheet SOM_SDMMC0_OUT_CMD
SOM_SDMMC0_OUT_D0: R168.1 U5.K2(DAT0) ; off-sheet SOM_SDMMC0_OUT_D0
SOM_SDMMC0_OUT_D1: R167.1 U5.N2(DAT1) ; off-sheet SOM_SDMMC0_OUT_D1
SOM_SDMMC0_OUT_D2: R166.1 U5.K3(DAT2) ; off-sheet SOM_SDMMC0_OUT_D2
SOM_SDMMC0_OUT_D3: R165.1 U5.N3(DAT3) ; off-sheet SOM_SDMMC0_OUT_D3
SOM_SDMMC0_OUT_D4: R164.1 U5.N8(DAT4) ; off-sheet SOM_SDMMC0_OUT_D4
SOM_SDMMC0_OUT_D5: R163.1 U5.K8(DAT5) ; off-sheet SOM_SDMMC0_OUT_D5
SOM_SDMMC0_OUT_D6: R162.1 U5.N9(DAT6) ; off-sheet SOM_SDMMC0_OUT_D6
SOM_SDMMC0_OUT_D7: R161.1 U5.K9(DAT7) ; off-sheet SOM_SDMMC0_OUT_D7
SOM_SDMMC0_OUT_DS: U5.K5(DS) ; off-sheet SOM_SDMMC0_OUT_DS
NetC118_2: C118.2 C119.2 U5.E4(VDDIM)
NetJP4_1: JP4.1 R172.2 R173.2
NetJP4_2: JP4.2 R404.1

Not connected (* = marked no-connect by the designer): U5 A1(NC)* A2(NC)* A9(NC)* A10(NC)* B1(NC)* B10(NC)* D2(RFU)* D3(RFU)* D4(RFU)* D5(RFU)* D6(RFU)* D7(RFU)* D8(RFU)* D9(RFU)* E2(RFU)* E3(RFU)* E5(RFU)* E6(RFU)* E7(RFU)* E8(RFU)* E9(RFU)* H4(RFU)* H5(RFU)* H6(RFU)* H7(RFU)* J2(RFU)* J3(RFU)* J4(RFU)* J6(RFU)* J7(RFU)* J8(RFU)* J9(RFU)* K4(RFU)* K6(RFU)* K7(RFU)* L5(RFU)* L6(RFU)* M2(RFU)* M3(RFU)* M6(RFU)* M8(RFU)* M9(RFU)* N4(RFU)* N5(RFU)* N6(RFU)* N7(RFU)* P4(RFU)* P7(RFU)* T1(NC)* T10(NC)* U1(NC)* U2(NC)* U9(NC)* U10(NC)*

### Layout directives
net class 50_eMMC1_MCU: SOM_SDMMC0_OUT_CK, SOM_SDMMC0_OUT_CMD, SOM_SDMMC0_OUT_D0, SOM_SDMMC0_OUT_D1, SOM_SDMMC0_OUT_D2, SOM_SDMMC0_OUT_D3, SOM_SDMMC0_OUT_D4, SOM_SDMMC0_OUT_D5, SOM_SDMMC0_OUT_D6, SOM_SDMMC0_OUT_D7

### Notes on the sheet
- [ver 1.1.0] Use SAMA7G54 instead
- 50Ω ±15% single ended
  Skew Sig/CK < 100ps(15mm)
  Max Length 100mm
- Reset button
- VCC
- VCCQ
- Project:
- Sub-system:
- Design by:
- Sheet title:
- Sheet
- of
- Checked by:
- Approved by:
- Revision:
- Document No:
- Size:
- Date:
- A3

### Library data of the parts
C118 = _CAP_C_2: CAP CHIP
C119 C122-C129 = _CAP_C_2: CAP
C120 C121 = _CAP_C_High_2: CAP
JP4 = JUMPER_1_1
R161-R173 R404 = _RES_B_2: RES
U5 = IC_eMMC_MTFC16GAKAEDQ-AIT TR

## Sheet USB_CAMERA_2.SchDoc
size 420 x 297 mm; SheetNumber: 15; SheetTotal: 34

### Notes on the sheet
- Project:
- Sub-system:
- Design by:
- Sheet title:
- Sheet
- of
- Checked by:
- Approved by:
- Revision:
- Document No:
- Size:
- Date:
- A3